# EAGLE design WildfireDetectionSystem (EAGLE 9.6.2)
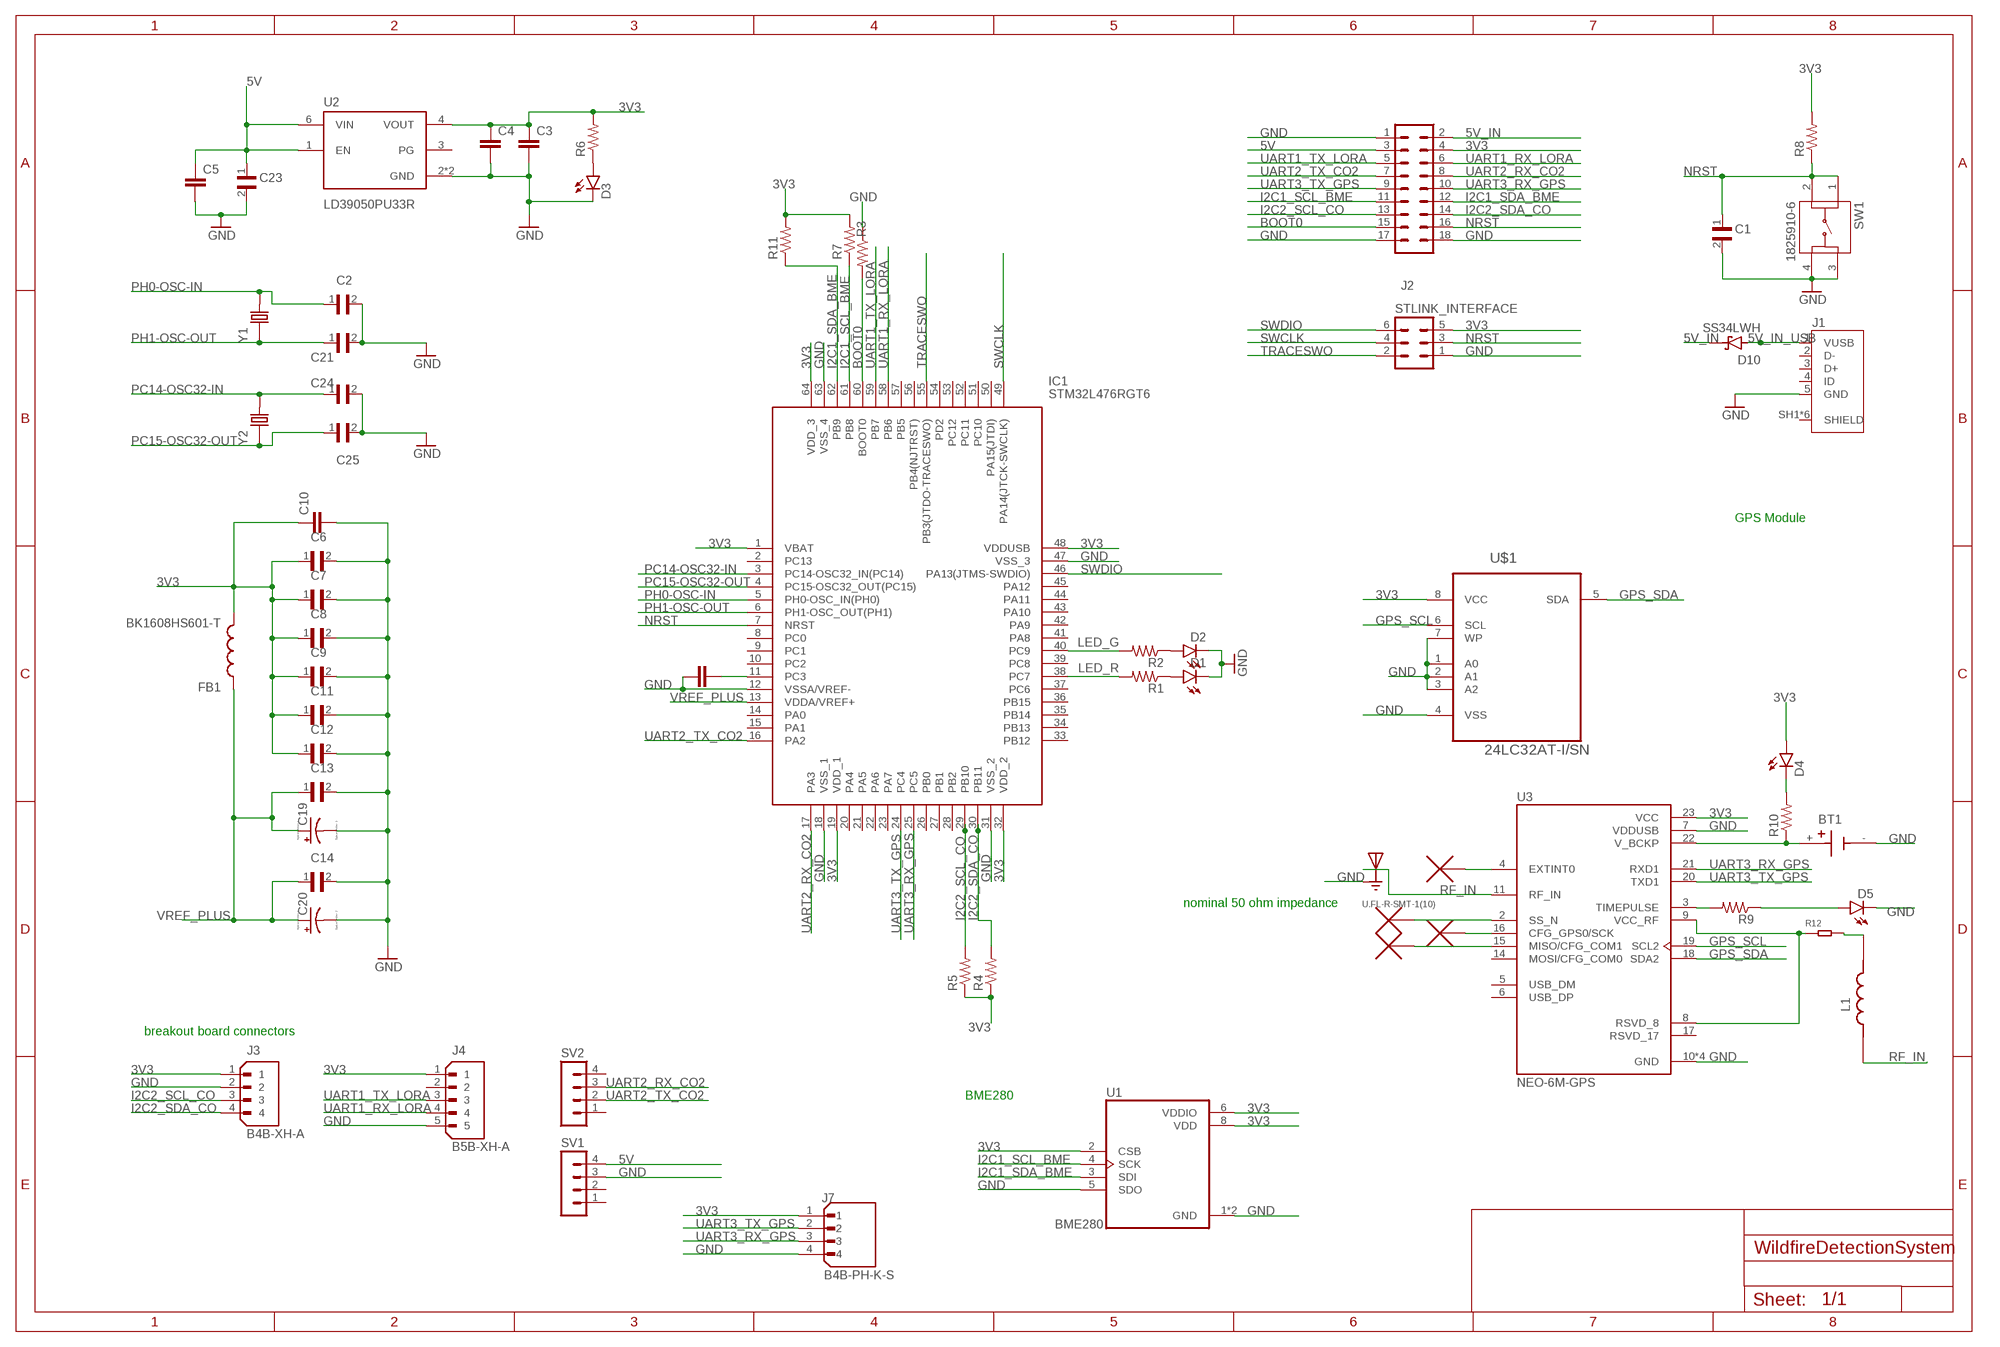
[diagram p0: schematic, sheet 1, part 1 of 2]
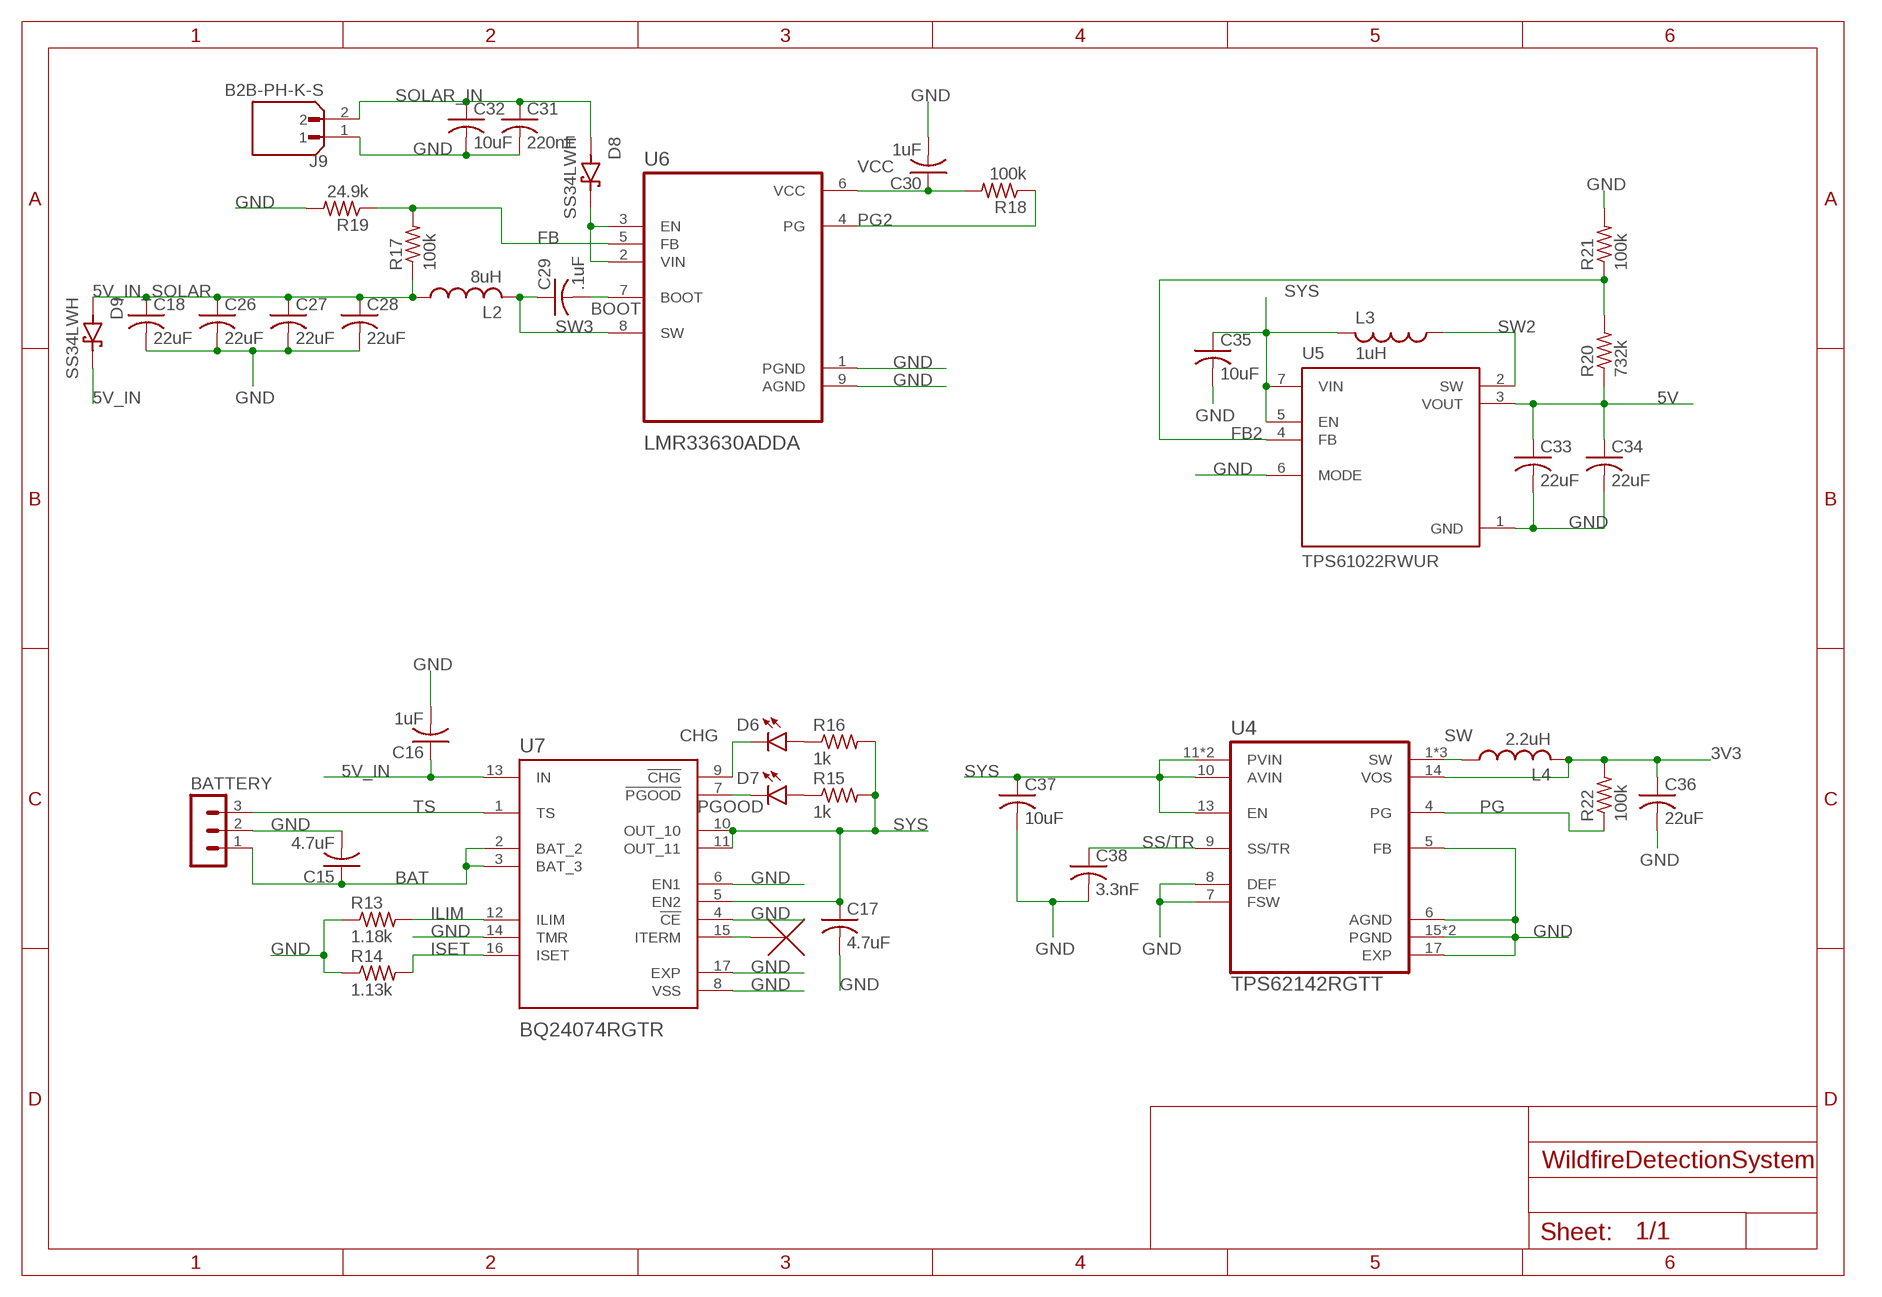
[diagram p1: schematic, sheet 1, part 2 of 2]

## Parts
BATTERY  MA03-1  [MA03-1]
BT1  MS621FE-FL11E  [BAT_MS621FE-FL11E]
C1  CL05B104KO5NNNC  [CAPC1005X55N]
C2  CL10C200JB8NNNC  [CAPC1608X90N]
C3  CC0402KRX7R7BB104  [CAPC1005X55N]
C4  CC0603KRX5R7BB105  [CAPC1608X90]
C5  CC0603KRX5R7BB105  [CAPC1608X90]
C6  CL05B104KO5NNNC  [CAPC1005X55N]
C7  CL05B104KO5NNNC  [CAPC1005X55N]
C8  CL05B104KO5NNNC  [CAPC1005X55N]
C9  CL05B104KO5NNNC  [CAPC1005X55N]
C10  CC0603KRX5R7BB105  [CAPC1608X90]
C11  CL05B104KO5NNNC  [CAPC1005X55N]
C12  CL05B104KO5NNNC  [CAPC1005X55N]
C13  CL05B104KO5NNNC  [CAPC1005X55N]
C14  CL05B104KO5NNNC  [CAPC1005X55N]
C15  4.7uF  C-USC0603  [C0603]
C16  1uF  C-USC0603  [C0603]
C17  4.7uF  C-USC0603  [C0603]
C18  22uF  C-USC0603  [C0603]
C19  TAJA105K016RNJ  [CAPPM3216X180N]
C20  TAJA105K016RNJ  [CAPPM3216X180N]
C21  CL10C200JB8NNNC  [CAPC1608X90N]
C22  CC0603KRX5R7BB105  [CAPC1608X90]
C23  CL05B104KO5NNNC  [CAPC1005X55N]
C24  CL10C200JB8NNNC  [CAPC1608X90N]
C25  CL10C200JB8NNNC  [CAPC1608X90N]
C26  22uF  C-USC0603  [C0603]
C27  22uF  C-USC0603  [C0603]
C28  22uF  C-USC0603  [C0603]
C29  .1uF  C-USC0603  [C0603]
C30  1uF  C-USC0603  [C0603]
C31  220nF  C-USC0603  [C0603]
C32  10uF  C-USC0603  [C0603]
C33  22uF  C-USC0603  [C0603]
C34  22uF  C-USC0603  [C0603]
C35  10uF  C-USC0603  [C0603]
C36  22uF  C-USC0603  [C0603]
C37  10uF  C-USC0603  [C0603]
C38  3.3nF  C-USC0603  [C0603]
D1  SML-P12MTT86  [LED_SML-P11UTT86R]
D2  SML-P12MTT86  [LED_SML-P11UTT86R]
D3  SML-P12MTT86  [LED_SML-P11UTT86R]
D4  SML-P12VTT86  [LED_SML-P11UTT86R]
D5  SML-P12MTT86  [LED_SML-P11UTT86R]
D6  SML-P12MTT86  [LED_SML-P11UTT86R]
D7  SML-P12VTT86  [LED_SML-P11UTT86R]
D8  SS34LWH  [SODFL3718X102N]
D9  SS34LWH  [SODFL3718X102N]
D10  SS34LWH  [SODFL3718X102N]
FB1  BK1608HS601-T  [BEADC1608X95N]
IC1  STM32L476RGT6  [QFP50P1200X1200X160-64N]
J1  10118192-0001LF  [AMPHENOL_10118192-0001LF]
J2  MA09-2  [MA09-2]
J3  B4B-XH-A  [JST_B4B-XH-A]
J4  B5B-XH-A  [JST_B5B-XH-A]
J7  B4B-PH-K-S  [JST_B4B-PH-K-S]
J8  U.FL-R-SMT-1(10)  [HRS_U.FL-R-SMT-1(10)]
J9  B2B-PH-K-S  [JST_B2B-PH-K-S]
L1  MLZ2012P220WT000  [INDC2012X145N]
L2  8uH  L-USL3225M  [L3225M]
L3  1uH  L-USL3225M  [L3225M]
L4  2.2uH  L-USL3225M  [L3225M]
R1  RC0402FR-071KL  [RESC1005X40N]
R2  RC0402FR-071KL  [RESC1005X40N]
R3  RC0402FR-071KL  [RESC1005X40N]
R4  RC0402FR-071KL  [RESC1005X40N]
R5  RC0402FR-071KL  [RESC1005X40N]
R6  RC0402FR-071KL  [RESC1005X40N]
R7  RT0402FRE074K7L  [RESC1005X35N]
R8  RC0402FR-0710KL  [RESC1005X40N]
R9  RC0402FR-071KL  [RESC1005X40N]
R10  RC0402FR-071KL  [RESC1005X40N]
R11  RT0402FRE074K7L  [RESC1005X35N]
R12  SMD-RES-22R-1%-1/16W(0402)  [R0402]
R13  1.18k  R-US_R0603  [R0603]
R14  1.13k  R-US_R0603  [R0603]
R15  1k  R-US_R0603  [R0603]
R16  1k  R-US_R0603  [R0603]
R17  100k  R-US_R0603  [R0603]
R18  100k  R-US_R0603  [R0603]
R19  24.9k  R-US_R0603  [R0603]
R20  732k  R-US_R0603  [R0603]
R21  100k  R-US_R0603  [R0603]
R22  100k  R-US_R0603  [R0603]
STLINK_INTERFACE  MA03-2  [MA03-2]
SV1  MA04-1  [MA04-1]
SV2  MA04-1  [MA04-1]
SW1  1825910-6  [SW_1825910-6-4]
U1  BME280  [PSON65P250X250X100-8N]
U2  LD39050PU33R  [SON95P300X300X100-7N]
U3  NEO-6M-GPS  [XCVR_NEO-6M-GPS]
U4  TPS62142RGTT  [QFN50P300X300X100-17N]
U5  TPS61022RWUR  [CONV_TPS61022RWUR]
U6  LMR33630ADDA  [VREG_LM5017MR/NOPB]
U7  BQ24074RGTR  [QFN50P300X300X100-17N]
U$1  24LC32AT-I/SN  [SOIC127P794X203-8N]
U$3  NC_MARKER  (no package)
U$4  NC_MARKER  (no package)
U$5  NC_MARKER  (no package)
U$6  NC_MARKER  (no package)
U$7  NC_MARKER  (no package)
Y1  ABLS-8.000MHZ-B2-T  [XTAL_ABLS-8.000MHZ-B2-T]
Y2  ECS-.327-12.5-12QS-TR  [XTAL_ECS-.327-12.5-12QS-TR]

## Nets
3V3: C3.1 C4.1 C6.1 C7.1 C8.1 C9.1 C10.1 C11.1 C12.1 C36.1 D4.A FB1.2 IC1.1(VBAT) IC1.19(VDD_1) IC1.32(VDD_2) IC1.48(VDDUSB) IC1.64(VDD_3) J2.4 J3.1 J4.1 J7.1 L4.2 R4.1 R5.1 R6.2 R7.2 R8.2 R11.2 R22.2 STLINK_INTERFACE.5 U1.2(CSB) U1.6(VDDIO) U1.8(VDD) U2.4(VOUT) U3.23(VCC) U4.14(VOS) U$1.8(VCC)
5V: C5.1 C23.1 C33.1 C34.1 J2.3 R20.1 SV1.4 U2.1(EN) U2.6(VIN) U5.3(VOUT)
5V_IN: C16.1 D9.C(K) D10.C(K) J2.2 U7.13(IN)
5V_IN_SOLAR: C18.1 C26.1 C27.1 C28.1 D9.A L2.1 R17.1
5V_IN_USB: D10.A J1.1(VUSB)
BAT: BATTERY.1 C15.1 U7.2(BAT_2) U7.3(BAT_3)
BOOT: C29.2 U6.7(BOOT)
BOOT0: IC1.60(BOOT0) J2.15 R3.2
CHG: D6.C U7.9(!CHG)
FB: R17.2 R19.1 U6.5(FB)
FB2: R20.2 R21.1 U5.4(FB)
GND: BATTERY.2 BT1.- C1.2 C2.2 C3.2 C4.2 C5.2 C6.2 C7.2 C8.2 C9.2 C10.2 C11.2 C12.2 C13.2 C14.2 C15.2 C16.2 C17.2 C18.2 C19.C(-) C20.C(-) C21.2 C22.1 C23.2 C24.2 C25.2 C26.2 C27.2 C28.2 C30.2 C31.2 C32.2 C33.2 C34.2 C35.2 C36.2 C37.2 C38.2 D1.C D2.C D3.C D5.C IC1.12(VSSA/VREF-) IC1.18(VSS_1) IC1.31(VSS_2) IC1.47(VSS_3) IC1.63(VSS_4) J1.5(GND) J2.1 J2.17 J2.18 J3.2 J4.5 J7.4 J8.1(GND) J8.3(GND) J9.1 R3.1 R13.1 R14.1 R19.2 R21.2 STLINK_INTERFACE.1 SV1.3 SW1.3 SW1.4 U1.1(GND) U1.5(SDO) U1.7(GND) U2.2(GND) U2.7(GND) U3.7(VDDUSB) U3.10(GND) U3.12(GND) U3.13(GND) U3.24(GND) U4.5(FB) U4.6(AGND) U4.7(FSW) U4.8(DEF) U4.15(PGND) U4.16(PGND) U4.17(EXP) U5.1(GND) U5.6(MODE) U6.1(PGND) U6.9(AGND) U7.4(!CE) U7.6(EN1) U7.8(VSS) U7.14(TMR) U7.17(EXP) U$1.1(A0) U$1.2(A1) U$1.3(A2) U$1.4(VSS) U$1.7(WP)
GPS_SCL: U3.19(SCL2) U$1.6(SCL)
GPS_SDA: U3.18(SDA2) U$1.5(SDA)
I2C1_SCL_BME: IC1.61(PB8) J2.11 R7.1 U1.4(SCK)
I2C1_SDA_BME: IC1.62(PB9) J2.12 R11.1 U1.3(SDI)
I2C2_SCL_CO: IC1.29(PB10) J2.13 J3.3 R5.2
I2C2_SDA_CO: IC1.30(PB11) J2.14 J3.4 R4.2
ILIM: R13.2 U7.12(ILIM)
ISET: R14.2 U7.16(ISET)
LED_G: IC1.40(PC9) R2.2
LED_R: IC1.38(PC7) R1.2
N$1: D3.A R6.1
N$2: D1.A R1.1
N$3: R9.2 U3.3(TIMEPULSE)
N$4: D2.A R2.1
N$5: U3.16(CFG_GPS0/SCK) U$3.P$1
N$6: C22.2 IC1.11(PC3)
N$7: D4.C R10.2
N$8: R12.1 U3.8(RSVD_8) U3.9(VCC_RF)
N$9: L1.2 R12.2
N$10: BT1.+ R10.1 U3.22(V_BCKP)
N$11: U3.4(EXTINT0) U$4.P$1
N$12: D5.A R9.1
N$13: U3.2(SS_N) U$6.P$1
N$14: U3.15(MISO/CFG_COM1) U$7.P$1
N$15: D8.C(K) U6.2(VIN) U6.3(EN)
N$17: D6.A R16.1
N$18: D7.A R15.1
N$28: U7.15(ITERM) U$5.P$1
NRST: C1.1 IC1.7(NRST) J2.16 R8.1 STLINK_INTERFACE.3 SW1.1 SW1.2
PC14-OSC32-IN: C24.1 IC1.3(PC14-OSC32_IN(PC14)) Y2.2
PC15-OSC32-OUT: C25.1 IC1.4(PC15-OSC32_OUT(PC15)) Y2.1
PG: R22.1 U4.4(PG)
PG2: R18.1 U6.4(PG)
PGOOD: D7.C U7.7(!PGOOD)
PH0-OSC-IN: C2.1 IC1.5(PH0-OSC_IN(PH0)) Y1.2
PH1-OSC-OUT: C21.1 IC1.6(PH1-OSC_OUT(PH1)) Y1.1
RF_IN: J8.2(SIG) L1.1 U3.11(RF_IN)
SOLAR_IN: C31.1 C32.1 D8.A J9.2
SS/TR: C38.1 U4.9(SS/TR)
SW: L4.1 U4.1(SW) U4.2(SW) U4.3(SW)
SW2: L3.1 U5.2(SW)
SW3: C29.1 L2.2 U6.8(SW)
SWCLK: IC1.49(PA14(JTCK-SWCLK)) STLINK_INTERFACE.4
SWDIO: IC1.46(PA13(JTMS-SWDIO)) STLINK_INTERFACE.6
SYS: C17.1 C35.1 C37.1 L3.2 R15.2 R16.2 U4.10(AVIN) U4.11(PVIN) U4.12(PVIN) U4.13(EN) U5.5(EN) U5.7(VIN) U7.5(EN2) U7.10(OUT_10) U7.11(OUT_11)
TRACESWO: IC1.55(PB3(JTDO-TRACESWO)) STLINK_INTERFACE.2
TS: BATTERY.3 U7.1(TS)
UART1_RX_LORA: IC1.58(PB6) J2.6 J4.4
UART1_TX_LORA: IC1.59(PB7) J2.5 J4.3
UART2_RX_CO2: IC1.17(PA3) J2.8 SV2.3
UART2_TX_CO2: IC1.16(PA2) J2.7 SV2.2
UART3_RX_GPS: IC1.25(PC5) J2.10 J7.3 U3.21(RXD1)
UART3_TX_GPS: IC1.24(PC4) J2.9 J7.2 U3.20(TXD1)
VCC: C30.1 R18.2 U6.6(VCC)
VREF_PLUS: C13.1 C14.1 C19.A(+) C20.A(+) FB1.1 IC1.13(VDDA/VREF+)
Unconnected: IC1.2(PC13) IC1.8(PC0) IC1.9(PC1) IC1.10(PC2) IC1.14(PA0) IC1.15(PA1) IC1.20(PA4) IC1.21(PA5) IC1.22(PA6) IC1.23(PA7) IC1.26(PB0) IC1.27(PB1) IC1.28(PB2) IC1.33(PB12) IC1.34(PB13) IC1.35(PB14) IC1.36(PB15) IC1.37(PC6) IC1.39(PC8) IC1.41(PA8) IC1.42(PA9) IC1.43(PA10) IC1.44(PA11) IC1.45(PA12) IC1.50(PA15(JTDI)) IC1.51(PC10) IC1.52(PC11) IC1.53(PC12) IC1.54(PD2) IC1.56(PB4(NJTRST)) IC1.57(PB5) J1.2(D-) J1.3(D+) J1.4(ID) J1.SH1(SHIELD) J1.SH2(SHIELD) J1.SH3(SHIELD) J1.SH4(SHIELD) J1.SH5(SHIELD) J1.SH6(SHIELD) J4.2 SV1.1 SV1.2 SV2.1 SV2.4 U2.3(PG) U3.5(USB_DM) U3.6(USB_DP) U3.14(MOSI/CFG_COM0) U3.17(RSVD_17)

## Notes on the sheet
- GPS Module
- nominal 50 ohm impedance
- breakout board connectors
- BME280

## Library data of the parts
BATTERY = con-lstb:MA03-1: PIN HEADER; OC_FARNELL: unknown; OC_NEWARK: unknown
BT1 = MS621FE-FL11E:MS621FE-FL11E; CHECK_PRICES: https://www.snapeda.com/parts/MS621FE-FL11E/Seiko/view-part/?ref=eda; DESCRIPTION: Coin, 6.8mm 3 V Lithium Battery Rechargeable (Secondary) 5.5mAh; DIGIKEY_PART_NUMBER: 728-1057-ND; MF: Seiko Instruments; MP: MS621FE-FL11E; PACKAGE: QFP-128 Seiko; SNAPEDA_LINK: https://www.snapeda.com/parts/MS621FE-FL11E/Seiko/view-part/?ref=snap
C1 C6-C9 C11-C14 C23 = CL05B104KO5NNNC:CL05B104KO5NNNC; CHECK_PRICES: https://www.snapeda.com/parts/CL05B104KO5NNNC/Samsung/view-part/?ref=eda; DESCRIPTION: 0.1 µF ±10% 16V Ceramic Capacitor X7R 0402 (1005 Metric); DIGIKEY_PART_NUMBER: 1276-1001-1-ND; MF: Samsung; MP: CL05B104KO5NNNC; PACKAGE: SMD-2 Samsung; SNAPEDA_LINK: https://www.snapeda.com/parts/CL05B104KO5NNNC/Samsung/view-part/?ref=snap
C2 C21 C24 C25 = CL10C200JB8NNNC:CL10C200JB8NNNC; CHECK_PRICES: https://www.snapeda.com/parts/CL10C200JB8NNNC/Samsung/view-part/?ref=eda; DESCRIPTION: 20 pF ±5% 50V Ceramic Capacitor C0G, NP0 0603 (1608 Metric); DIGIKEY_PART_NUMBER: 1276-1187-1-ND; MF: Samsung; MP: CL10C200JB8NNNC; PACKAGE: SMD-2 Samsung; SNAPEDA_LINK: https://www.snapeda.com/parts/CL10C200JB8NNNC/Samsung/view-part/?ref=snap
C3 = ce-capstone:CC0402KRX7R7BB104: .1UF 16V 10% 0402; DESCRIPTION: 0.1µF ±10% 16V Ceramic Capacitor X7R 0402 _1005 Metric_; DIGI-KEY_PART_NUMBER: 311-1338-1-ND; DIGI-KEY_PURCHASE_URL: https://www.digikey.com/product-detail/en/yageo/CC0402KRX7R7BB104/311-1338-1-ND/2103122?utm_source=snapeda&utm_medium=aggregator&utm_campaign=symbol; MF: Yageo; MP: CC0402KRX7R7BB104; PACKAGE: 0402 Yageo
C4 C5 C10 C22 = ce-capstone:CC0603KRX5R7BB105: CAPACITOR CERAMIC, 1µF, 10V, X5R, 0603; Dielectric Characteristic:X5R; Capacitance:1µF; Capacitance Tolerance:± 10%; Voltage Rating:16V; Temperature Coefficient:± 15%; Capacitor Case Style:0603; No. of Pins:2; Mounting Type:SMD ;RoHS Compliant: Yes; DESCRIPTION: 1µF ±10% 16V Ceramic Capacitor X5R 0603 _1608 Metric_; DIGI-KEY_PART_NUMBER: 311-1444-1-ND; DIGI-KEY_PURCHASE_URL: https://www.digikey.com/product-detail/en/yageo/CC0603KRX5R7BB105/311-1444-1-ND/2833750?utm_source=snapeda&utm_medium=aggregator&utm_campaign=symbol; MF: Yageo; MP: CC0603KRX5R7BB105; PACKAGE: 0603 Yageo
C15-C18 C26-C38 = rcl:C-US: CAPACITOR, American symbol; SPICEPREFIX: C
C19 C20 = ce-capstone:TAJA105K016RNJ: Capacitor tantalum TAJ 1206 1uF 16V AVX 1uF SMD Solid MnO2 Tantalum Electrolytic Capacitor, 16 V dc +/-10%, TAJ Series Source: Datasheet <http://www.farnell.com/datasheets/1680476.pdf>; ALLIED_NUMBER: 70474975; ALLIED_PRICE-STOCK: https://www.alliedelec.com/avx-taja105k016r/70474975/; DESCRIPTION: Capacitor tantalum TAJ 1206 1uF 16V AVX 1uF SMD Solid MnO2 Tantalum Electrolytic Capacitor, 16 V dc +/-10%, TAJ Series; HEIGHT: 1.8mm; MANUFACTURER_NAME: AVX; MANUFACTURER_PART_NUMBER: TAJA105K016RNJ; MOUSER_PART_NUMBER: 581-TAJA105K016RNJ; MOUSER_PRICE-STOCK: https://www.mouser.com/Search/Refine.aspx?Keyword=581-TAJA105K016R; RS_PART_NUMBER: 6992804P; RS_PRICE-STOCK: http://uk.rs-online.com/web/p/products/6992804P
D1-D3 D5 D6 = ce-capstone:SML-P12MTT86: SML-P1 Series Red 0402 Clear 60 mcd 2 V Surface Mount PICOLED LED; AVAILABILITY: Unavailable; DESCRIPTION: Green 572nm LED Indication - Discrete 2V 0402 _1006 Metric_; MF: Rohm; MP: SML-P12MTT86; PACKAGE: 0402 Rohm; PRICE: None
D4 D7 = ce-capstone:SML-P12VTT86: SML-P1 Series Red 0402 Clear 60 mcd 2 V Surface Mount PICOLED LED; AVAILABILITY: Unavailable; DESCRIPTION: Red 630nm LED Indication - Discrete 2V 0402 _1006 Metric_; MF: Rohm; MP: SML-P12VTT86; PACKAGE: 0402 Rohm; PRICE: None
D8-D10 = SS34LWH:SS34LWH: Check availability <https://pricing.snapeda.com/parts/SS34LWH/Taiwan%20Semiconductor/view-part?ref=eda>; AVAILABILITY: In Stock; CHECK_PRICES: https://www.snapeda.com/parts/SS34LWH/taiwan/view-part/?ref=eda; DESCRIPTION: 3A, 40V, Automotive Planar Schottky; MF: Taiwan Semiconductor; MP: SS34LWH; PACKAGE: SOD-123W-2 Taiwan Semiconductor; PRICE: None; SNAPEDA_LINK: https://www.snapeda.com/parts/SS34LWH/taiwan/view-part/?ref=snap
FB1 = ce-capstone:BK1608HS601-T: Ferrite Chip Bead(Lead Free) Source: Datasheet <https://www.tai-tech.com.tw/_upload/files/FCM1608-Series.pdf>; DESCRIPTION: Ferrite Chip Bead(Lead Free); HEIGHT: 0.95mm; MANUFACTURER_NAME: Taiyo Yuden; MANUFACTURER_PART_NUMBER: BK1608HS601-T
IC1 = STM32L476RGT6:STM32L476RGT6: ARM MCU 32-bit 80MHz 1024KB LQFP64 STMicroelectronics STM32L476RGT6, 32bit ARM Cortex M4 MCU, 80MHz, 1 MB Flash, 64-Pin LQFP Source: Datasheet <https://www.st.com/resource/en/datasheet/stm32l476je.pdf>; ARROW_PART_NUMBER: STM32L476RGT6; ARROW_PRICE-STOCK: https://www.arrow.com/en/products/stm32l476rgt6/stmicroelectronics?utm_currency=USD&region=nac; DESCRIPTION: ARM MCU 32-bit 80MHz 1024KB LQFP64 STMicroelectronics STM32L476RGT6, 32bit ARM Cortex M4 MCU, 80MHz, 1 MB Flash, 64-Pin LQFP; HEIGHT: 1.6mm; MANUFACTURER_NAME: STMicroelectronics; MANUFACTURER_PART_NUMBER: STM32L476RGT6; MOUSER_PART_NUMBER: 511-STM32L476RGT6; MOUSER_PRICE-STOCK: https://www.mouser.co.uk/ProductDetail/STMicroelectronics/STM32L476RGT6?qs=o58qnh%2FCpu44V%252B7CaDZzCA%3D%3D
J1 = ce-capstone:10118192-0001LF: Single Port 5 Contact Horizontal Right Angle Shielded Micro B USB 2.0 Connector; AVAILABILITY: Unavailable; DESCRIPTION: USB - micro B USB 2.0 Receptacle Connector 5 Position Surface Mount, Right Angle; MF: Amphenol ICC; MP: 10118192-0001LF; PACKAGE: None; PRICE: None
J2 = con-lstb:MA09-2: PIN HEADER; OC_FARNELL: unknown; OC_NEWARK: unknown
J3 = B4B-XH-A:B4B-XH-A; CHECK_PRICES: https://www.snapeda.com/parts/B4B-XH-A/JST/view-part/?ref=eda; DESCRIPTION: Conn Shrouded Header (4 Sides) HDR 4 POS 2.5mm Solder ST Top Entry Thru-Hole Box; DIGIKEY_PART_NUMBER: 455-B4B-XH-A-ND; MF: JST; MP: B4B-XH-A; PACKAGE: None; SNAPEDA_LINK: https://www.snapeda.com/parts/B4B-XH-A/JST/view-part/?ref=snap
J4 = B5B-XH-A:B5B-XH-A; CHECK_PRICES: https://www.snapeda.com/parts/B5B-XH-A/JST/view-part/?ref=eda; DESCRIPTION: JST Pin header, single-row straight 5-pin Header / Plug 5 Positions 2.5mm; DIGIKEY_PART_NUMBER: 455-B5B-XH-A-ND; MF: JST; MP: B5B-XH-A; PACKAGE: None; SNAPEDA_LINK: https://www.snapeda.com/parts/B5B-XH-A/JST/view-part/?ref=snap
J7 = B4B-PH-K-S:B4B-PH-K-S: Check availability <https://pricing.snapeda.com/parts/B4B-PH-K-S/JST%20Sales/view-part?ref=eda>; AVAILABILITY: In Stock; CHECK_PRICES: https://www.snapeda.com/parts/B4B-PH-K-S/JST/view-part/?ref=eda; DESCRIPTION: Connector Header Through Hole 4 position 0.079 (2.00mm); MF: JST Sales; MP: B4B-PH-K-S; PACKAGE: None; PRICE: None; PURCHASE-URL: https://www.snapeda.com/api/url_track_click_mouser/?unipart_id=515305&manufacturer=JST Sales&part_name=B4B-PH-K-S&search_term=b4b-ph-k-s; SNAPEDA_LINK: https://www.snapeda.com/parts/B4B-PH-K-S/JST/view-part/?ref=snap
J8 = U.FL-R-SMT-1_10_:U.FL-R-SMT-1(10): Check availability <https://pricing.snapeda.com/parts/U.FL-R-SMT-1%2810%29/Hirose/view-part?ref=eda>; AVAILABILITY: In Stock; CHECK_PRICES: https://www.snapeda.com/parts/U.FL-R-SMT-1(10)/Hirose+Electric+Co+Ltd/view-part/?ref=eda; DESCRIPTION: U.FL (UMCC) Connector Receptacle, Male Pin 50 Ohms Surface Mount Solder; MF: Hirose; MP: U.FL-R-SMT-1(10); PACKAGE: None; PRICE: None; PURCHASE-URL: https://www.snapeda.com/api/url_track_click_mouser/?unipart_id=55192&manufacturer=Hirose&part_name=U.FL-R-SMT-1(10)&search_term=u.fl-r-smt-1(10); SNAPEDA_LINK: https://www.snapeda.com/parts/U.FL-R-SMT-1(10)/Hirose+Electric+Co+Ltd/view-part/?ref=snap
J9 = B2B-PH-K-S:B2B-PH-K-S: Check availability <https://pricing.snapeda.com/parts/B2B-PH-K-S/JST%20Sales/view-part?ref=eda>; AVAILABILITY: In Stock; CHECK_PRICES: https://www.snapeda.com/parts/B2B-PH-K-S/JST/view-part/?ref=eda; DESCRIPTION: Connector Header Through Hole 2 position 0.079 (2.00mm); MF: JST Sales; MP: B2B-PH-K-S; PACKAGE: None; PRICE: None; PURCHASE-URL: https://www.snapeda.com/api/url_track_click_mouser/?unipart_id=473612&manufacturer=JST Sales&part_name=B2B-PH-K-S&search_term=b2b-ph-k-s; SNAPEDA_LINK: https://www.snapeda.com/parts/B2B-PH-K-S/JST/view-part/?ref=snap
L1 = MLZ2012P220WT000:MLZ2012P220WT000; CHECK_PRICES: https://www.snapeda.com/parts/MLZ2012P220WT000/TDK/view-part/?ref=eda; DESCRIPTION: 22 µH Shielded Multilayer Inductor 220 mA 1.25Ohm 0805 (2012 Metric); DIGIKEY_PART_NUMBER: 445-15751-1-ND; MF: TDK; MP: MLZ2012P220WT000; PACKAGE: 2012 Bourns; SNAPEDA_LINK: https://www.snapeda.com/parts/MLZ2012P220WT000/TDK/view-part/?ref=snap
L2-L4 = rcl:L-US: INDUCTOR, American symbol; SPICEPREFIX: L
R1-R6 R9 R10 = ce-capstone:RC0402FR-071KL: RES SMD 1k OHM 1% 1/16W 0402; DESCRIPTION: 510 Ohms ±1% 0.063W, 1/16W Chip Resistor 0402 _1005 Metric_ Moisture Resistant Thick Film; DIGI-KEY_PART_NUMBER: 311-510LRCT-ND; DIGI-KEY_PURCHASE_URL: https://www.digikey.com/product-detail/en/yageo/RC0402FR-07510RL/311-510LRCT-ND/729579?utm_source=snapeda&utm_medium=aggregator&utm_campaign=symbol; MF: Yageo; MP: RC0402FR-07510RL; PACKAGE: 1005 Panasonic Electronic Components
R7 R11 = ce-capstone:RT0402FRE074K7L: RES SMD 4.7K OHM 1% 1/16W 0402; DESCRIPTION: 4.7 kOhms ±1% 0.063W, 1/16W Chip Resistor 0402 _1005 Metric_ Thin Film; DIGI-KEY_PART_NUMBER: YAG3347CT-ND; DIGI-KEY_PURCHASE_URL: https://www.digikey.com/product-detail/en/yageo/RT0402FRE074K7L/YAG3347CT-ND/5418052?utm_source=snapeda&utm_medium=aggregator&utm_campaign=symbol; MF: Yageo; MP: RT0402FRE074K7L; PACKAGE: 1005 Yageo
R8 = ce-capstone:RC0402FR-0710KL: RES SMD 10k OHM 1% 1/16W 0402; DESCRIPTION: 510 Ohms ±1% 0.063W, 1/16W Chip Resistor 0402 _1005 Metric_ Moisture Resistant Thick Film; DIGI-KEY_PART_NUMBER: 311-510LRCT-ND; DIGI-KEY_PURCHASE_URL: https://www.digikey.com/product-detail/en/yageo/RC0402FR-07510RL/311-510LRCT-ND/729579?utm_source=snapeda&utm_medium=aggregator&utm_campaign=symbol; MF: Yageo; MP: RC0402FR-07510RL; PACKAGE: 1005 Panasonic Electronic Components
R12 = SMD-RES-22R-1_-1_16W_0402_:SMD-RES-22R-1%-1/16W(0402); CHECK_PRICES: https://www.snapeda.com/parts/RC0402FR-0722RL/Yageo/view-part/?ref=eda; DESCRIPTION: 22 Ohms ±1% 0.063W, 1/16W Chip Resistor 0402 (1005 Metric) Moisture Resistant Thick Film; DIGIKEY_PART_NUMBER: 311-22.0LRCT-ND; MF: Yageo; MP: RC0402FR-0722RL; PACKAGE: 0402 Yageo; SNAPEDA_LINK: https://www.snapeda.com/parts/RC0402FR-0722RL/Yageo/view-part/?ref=snap
R13-R22 = rcl:R-US_: RESISTOR, American symbol; SPICEPREFIX: R
STLINK_INTERFACE = con-lstb:MA03-2: PIN HEADER; OC_FARNELL: unknown; OC_NEWARK: unknown
SV1 SV2 = con-lstb:MA04-1: PIN HEADER; OC_FARNELL: unknown; OC_NEWARK: unknown
SW1 = ce-capstone:1825910-6: Switch Tactile OFF (ON) SPST Round Button PC Pins 0.05A 24VDC 100000Cycles 1.57N Thru-Hole Loose; AVAILABILITY: Unavailable; COMMENT: 1825910-6; CONFIGURATION_POLE-THROW: Single Pole - Single Throw; CONTACT_CURRENT_RATING: 50 mA; DESCRIPTION: Switch Push Button OFF _ON_ SPST Round Button 0.05A 24VDC Momentary Contact PC Pins Thru-Hole; EU_ROHS_COMPLIANCE: Compliant; MF: TE Connectivity; MP: 1825910-6; PACKAGE: None; PRICE: None; TE_PURCHASE_URL: https://www.te.com/usa-en/product-1825910-6.html?te_bu=Cor&te_type=disp&te_campaign=seda_glo_cor-seda-global-disp-prtnr-fy19-seda-model-bom-cta_sma-317_1&elqCampaignId=32493
U1 = BME280:BME280; CHECK_PRICES: https://www.snapeda.com/parts/BME280/Bosch/view-part/?ref=eda; DESCRIPTION: Board Mount Humidity Sensors MEMS humidity, pressure and temperature sensor; DIGIKEY_PART_NUMBER: 828-1063-1-ND; MF: Bosch; MP: BME280; PACKAGE: LGA-8 Bosch; SNAPEDA_LINK: https://www.snapeda.com/parts/BME280/Bosch/view-part/?ref=snap
U2 = ce-capstone:LD39050PU33R: LD39050 Series 500 mA 3.3 V Fixed Low Noise LDO Voltage Regulator - DFN-6; AVAILABILITY: Unavailable; DESCRIPTION: Linear Voltage Regulator IC 1 Output 500mA 6-DFN _3x3_; MF: STMicroelectronics; MP: LD39050PU33R; PACKAGE: DFN-6 STMicroelectronics; PRICE: None
U3 = NEO-6M-GPS:NEO-6M-GPS: Check availability <https://pricing.snapeda.com/parts/NEO-6M-GPS/u-blox/view-part?ref=eda>; AVAILABILITY: Not in stock; CHECK_PRICES: https://www.snapeda.com/parts/NEO-6M-GPS/u-blox/view-part/?ref=eda; DESCRIPTION: GPS Development Tools SparkFun GNSS-RTK Dead Reckoning Breakout - ZED-F9K (Qwiic); MF: u-blox; MP: NEO-6M-GPS; PACKAGE: None; PRICE: None; SNAPEDA_LINK: https://www.snapeda.com/parts/NEO-6M-GPS/u-blox/view-part/?ref=snap
U4 = TPS62142RGTT:TPS62142RGTT: Check availability <https://pricing.snapeda.com/parts/TPS62142RGTT/Texas%20Instruments/view-part?ref=eda>; AVAILABILITY: In Stock; CHECK_PRICES: https://www.snapeda.com/parts/TPS62142RGTT/Texas+Instruments/view-part/?ref=eda; DESCRIPTION: 3–17V 2A Step-Down Converter in 3x3 QFN package; MF: Texas Instruments; MP: TPS62142RGTT; PACKAGE: VQFN-16 Texas Instruments; PRICE: None; PURCHASE-URL: https://www.snapeda.com/api/url_track_click_mouser/?unipart_id=1002928&manufacturer=Texas Instruments&part_name=TPS62142RGTT&search_term=tps62142rgtt; SNAPEDA_LINK: https://www.snapeda.com/parts/TPS62142RGTT/Texas+Instruments/view-part/?ref=snap
U5 = TPS61022RWUR:TPS61022RWUR: Check availability <https://pricing.snapeda.com/parts/TPS61022RWUR/Texas%20Instruments/view-part?ref=eda>; AVAILABILITY: In Stock; CHECK_PRICES: https://www.snapeda.com/parts/TPS61022RWUR/Texas+Instruments/view-part/?ref=eda; DESCRIPTION: 8-A boost converter with 0.5-V ultra-low input voltage; MF: Texas Instruments; MP: TPS61022RWUR; PACKAGE: VQFN-HR-7 Texas Instruments; PRICE: None; SNAPEDA_LINK: https://www.snapeda.com/parts/TPS61022RWUR/Texas+Instruments/view-part/?ref=snap
U6 = LMR33630ADDA:LMR33630ADDA: Check availability <https://pricing.snapeda.com/parts/LMR33630ADDA/Texas%20Instruments/view-part?ref=eda>; AVAILABILITY: In Stock; CHECK_PRICES: https://www.snapeda.com/parts/LMR33630ADDA/Texas+Instruments/view-part/?ref=eda; DESCRIPTION: SIMPLE SWITCHER® 3.8V to 36V, 3A Synchronous Buck Converter With Ultra-Low EMI; MF: Texas Instruments; MP: LMR33630ADDA; PACKAGE: HSOIC-8 Texas Instruments; PRICE: None; PURCHASE-URL: https://www.snapeda.com/api/url_track_click_mouser/?unipart_id=2751243&manufacturer=Texas Instruments&part_name=LMR33630ADDA&search_term=lmr33630adda; SNAPEDA_LINK: https://www.snapeda.com/parts/LMR33630ADDA/Texas+Instruments/view-part/?ref=snap
U7 = BQ24074RGTR:BQ24074RGTR: Check availability <https://pricing.snapeda.com/parts/BQ24074RGTR/Texas%20Instruments/view-part?ref=eda>; AVAILABILITY: In Stock; CHECK_PRICES: https://www.snapeda.com/parts/BQ24074RGTR/Texas+Instruments/view-part/?ref=eda; DESCRIPTION: Standalone 1-cell 1.5-A linear battery charger, Power Path, 4.2-V VBAT, 10.5-V OVP and 4.4-V VOUT; MF: Texas Instruments; MP: BQ24074RGTR; PACKAGE: VQFN-16 Texas Instruments; PRICE: None; SNAPEDA_LINK: https://www.snapeda.com/parts/BQ24074RGTR/Texas+Instruments/view-part/?ref=snap
U$1 = 24LC32AT-I_SN:24LC32AT-I/SN; CHECK_PRICES: https://www.snapeda.com/parts/24LC32AT-I/SN/Microchip+Technology/view-part/?ref=eda; DESCRIPTION: 32K, 4K X 8, 2.5V SER EE IND8 SOIC 3.90mm(.150in) T/R | Microchip Technology Inc. 24LC32AT-I/SN; DIGIKEY_PART_NUMBER: 24LC32AT-I/SNCT-ND; MF: Microchip Technology; MP: 24LC32AT-I/SN; PACKAGE: SOIC-8 Microchip; SNAPEDA_LINK: https://www.snapeda.com/parts/24LC32AT-I/SN/Microchip+Technology/view-part/?ref=snap
U$3-U$7 = NC_MARKER:NC_MARKER
Y1 = ce-capstone:ABLS-8.000MHZ-B2-T: Crystal 8MHz Â±20ppm (Tol) Â±50ppm (Stability) 18pF FUND 80Ohm 2-Pin HC-49/US SMD T/R; AVAILABILITY: Unavailable; DESCRIPTION: 8MHz ±20ppm Crystal 18pF 80 Ohms HC-49/US; MF: Abracon LLC; MP: ABLS-8.000MHZ-B2; PACKAGE: HC-49/US Abracon LLC; PRICE: None
Y2 = ce-capstone:ECS-.327-12.5-12QS-TR: SMD CRYSTAL 32.768 KHz; AVAILABILITY: Unavailable; DESCRIPTION: 32.768kHz ±20ppm Crystal 12.5pF 90 kOhms 2-SMD, No Lead; MF: ECS Inc.; MP: ECS-.327-12.5-12QS-TR; PACKAGE: SMD-2 ECS International; PRICE: None

## Board
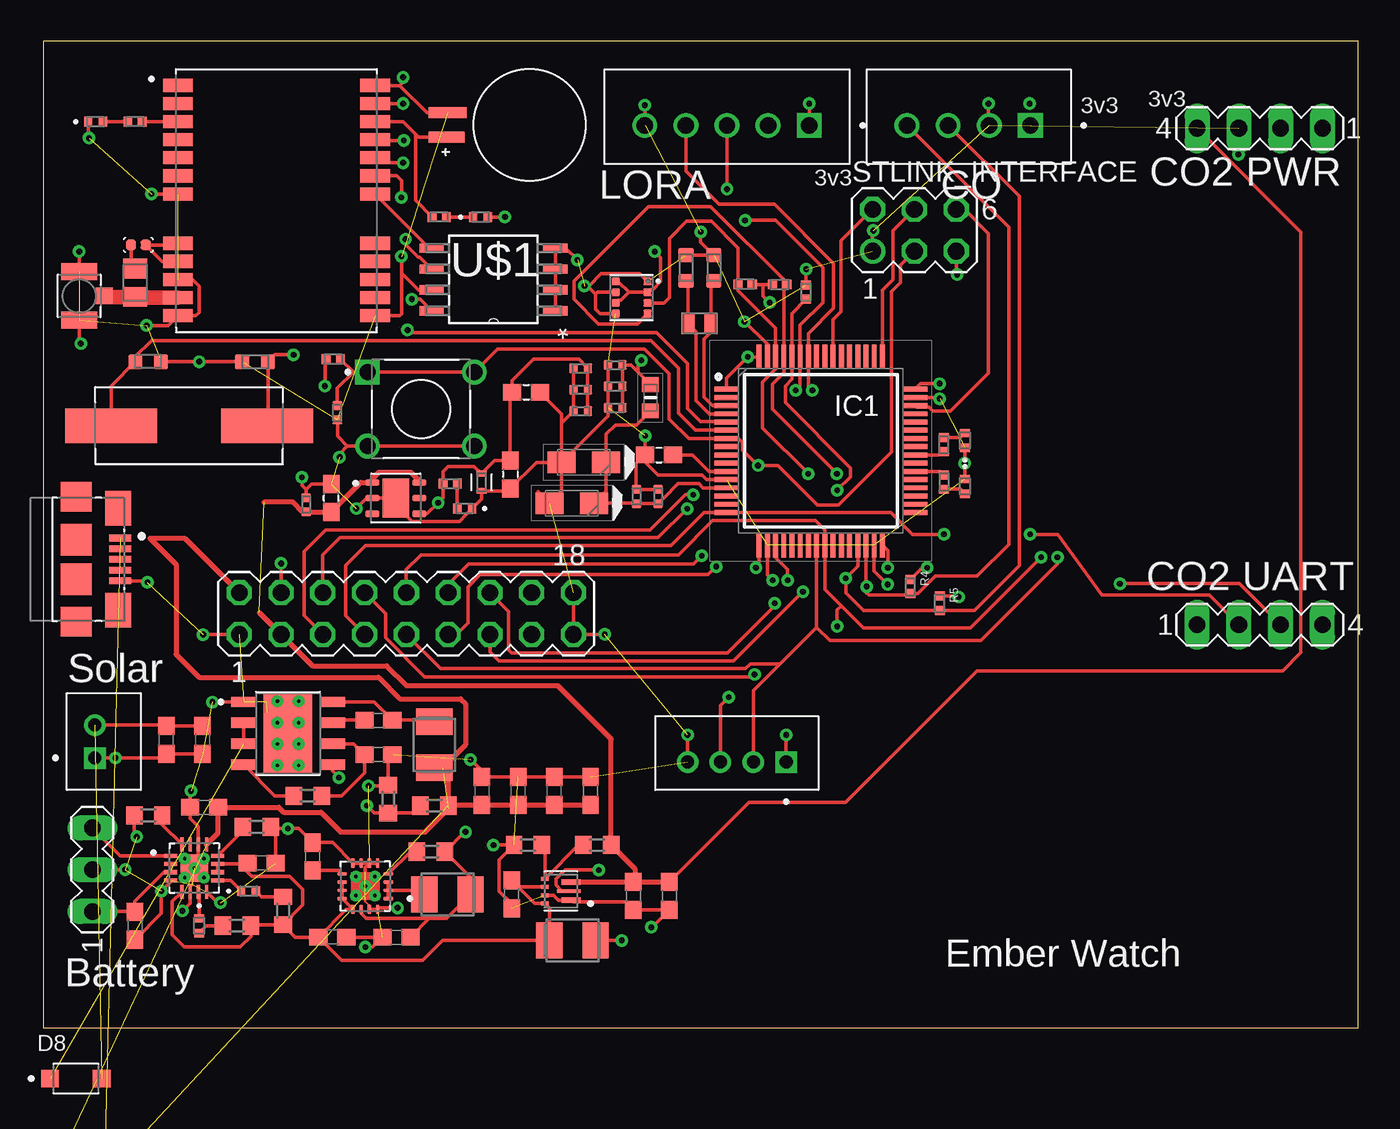
[diagram p2: board, top side]
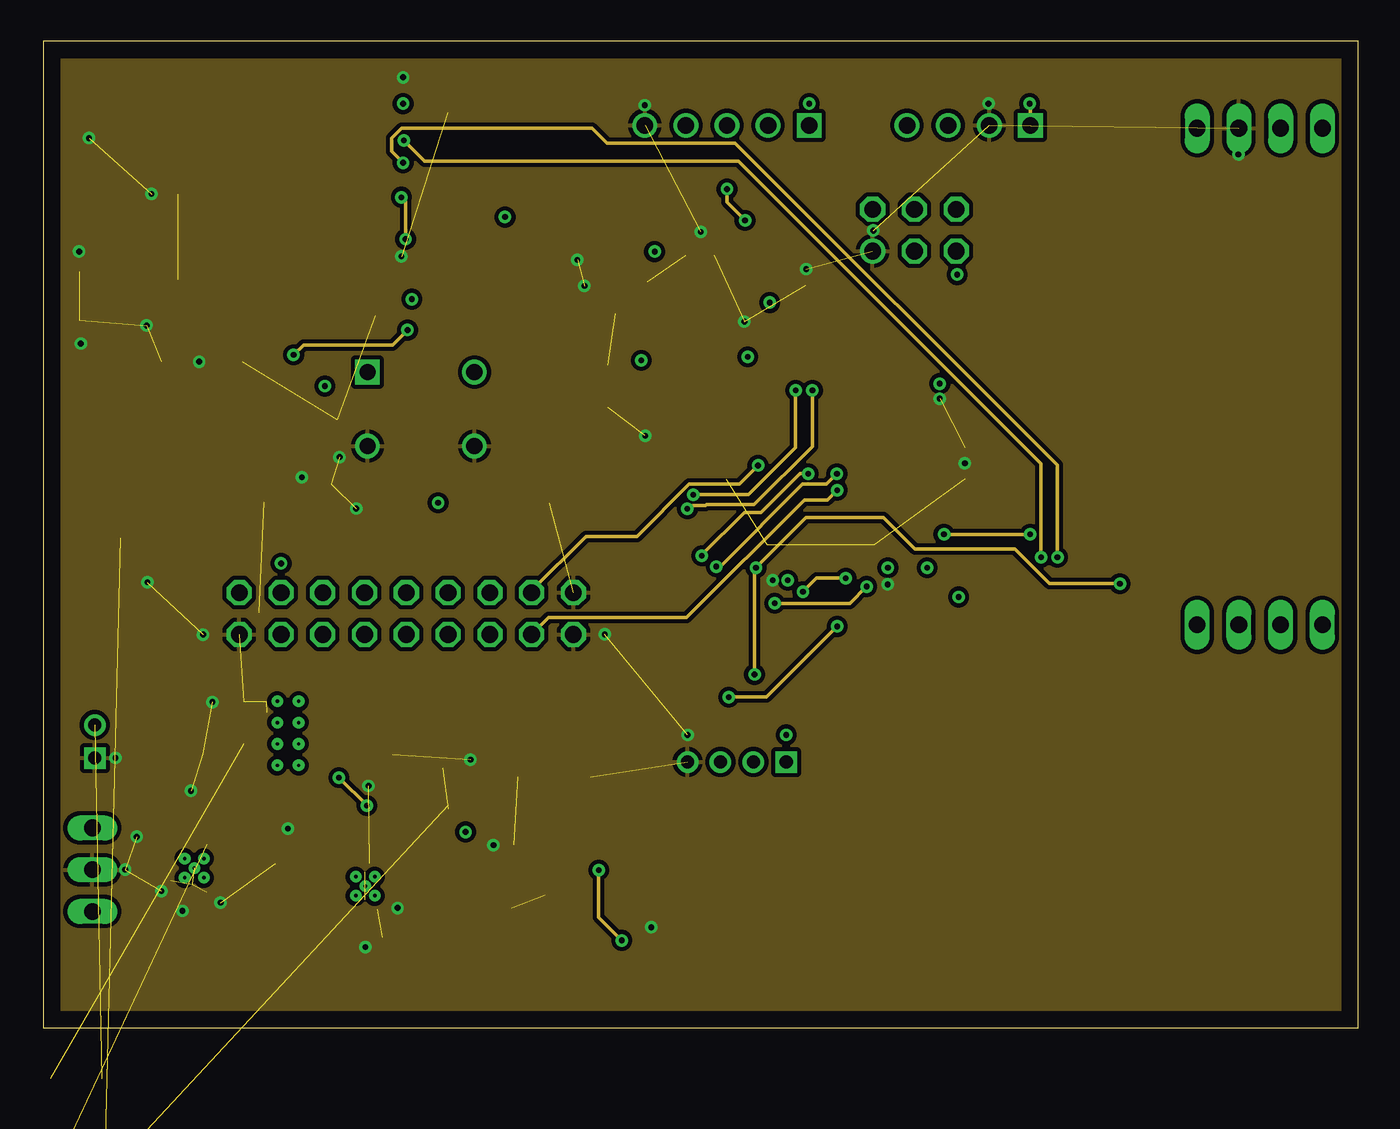
[diagram p3: board, inner layer Route2]
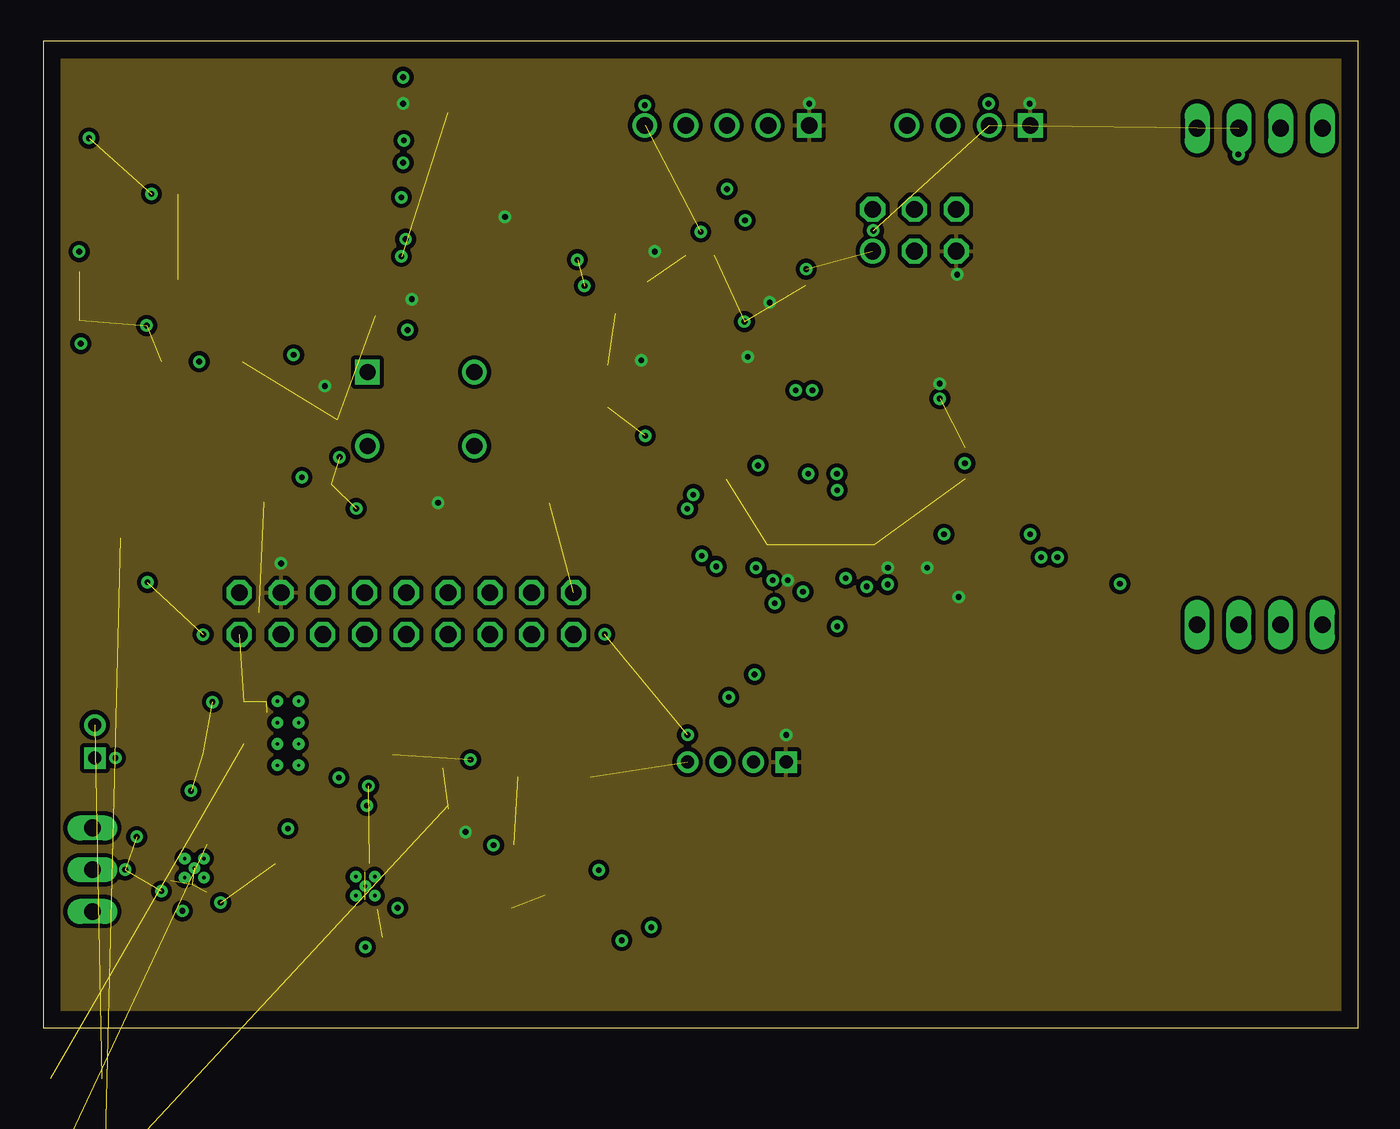
[diagram p4: board, inner layer Route3]

Size 80 x 60 mm. Coordinates in mm from the lower left corner, seen from the top.
Outline: 0,0 80,0 80,60 0,60 0,0
Copper layers (1+2*15+16): Top 0.035mm / dielectric 0.5mm / Route2 0.035mm / dielectric 0.15mm / Route15 0.035mm / dielectric 0.2mm / Bottom 0.035mm
Design rules "default *": minimum track width 6mil, minimum drill 0.2mm, track to track 10mil, track to pad 6mil, pad to pad 6mil, via to via 6mil, smd to smd 6mil, copper to edge 40mil, drill to drill 6mil, minimum pad ring 10mil, minimum via ring 8mil, stop-mask expansion 4mil, vias tented up to drill 0mil, thermal gap 10mil

### Footprints (pad centres in the part's own frame; a part is rotated, then mirrored left to right if it is on the bottom)
MA03-1 = drill 1.016 long: 1 -2.54,0; 2 0,0; 3 2.54,0
BAT_MS621FE-FL11E = smd 2.2 x 0.65: + 5.05,0.75 | smd 2.3 x 0.65: - 5,-0.75
CAPC1005X55N = smd 0.54 x 0.6: 1 -0.432,0; 2 0.432,0
CAPC1608X90N = smd 0.87 x 0.93: 1 -0.78,0; 2 0.78,0
CAPC1005X55N' = smd 0.35 x 0.6: 1 -0.525,0; 2 0.525,0
CAPC1608X90 = smd 1.1 x 1: 1 -0.85,0; 2 0.85,0
C0603 = smd 1.1 x 1: 1 -0.85,0; 2 0.85,0
CAPPM3216X180N = smd 1.7 x 1.3: A -1.35,0; C 1.35,0
LED_SML-P11UTT86R = smd 0.5 x 0.6: A 0.45,0; C -0.45,0
SODFL3718X102N = smd 1.08 x 1.09: A 1.575,0; C -1.575,0
BEADC1608X95N = smd 0.9 x 1: 1 -0.8,0; 2 0.8,0
QFP50P1200X1200X160-64N = smd 1.475 x 0.3: 1 -5.738,3.75; 2 -5.738,3.25; 3 -5.738,2.75; 4 -5.738,2.25; 5 -5.738,1.75; 6 -5.738,1.25; 7 -5.738,0.75; 8 -5.738,0.25; 9 -5.738,-0.25; 10 -5.738,-0.75; 11 -5.738,-1.25; 12 -5.738,-1.75; 13 -5.738,-2.25; 14 -5.738,-2.75; 15 -5.738,-3.25; 16 -5.738,-3.75; 33 5.738,-3.75; 34 5.738,-3.25; 35 5.738,-2.75; 36 5.738,-2.25; 37 5.738,-1.75; 38 5.738,-1.25; 39 5.738,-0.75; 40 5.738,-0.25; 41 5.738,0.25; 42 5.738,0.75; 43 5.738,1.25; 44 5.738,1.75; 45 5.738,2.25; 46 5.738,2.75; 47 5.738,3.25; 48 5.738,3.75 | smd 0.3 x 1.475: 17 -3.75,-5.738; 18 -3.25,-5.738; 19 -2.75,-5.738; 20 -2.25,-5.738; 21 -1.75,-5.738; 22 -1.25,-5.738; 23 -0.75,-5.738; 24 -0.25,-5.738; 25 0.25,-5.738; 26 0.75,-5.738; 27 1.25,-5.738; 28 1.75,-5.738; 29 2.25,-5.738; 30 2.75,-5.738; 31 3.25,-5.738; 32 3.75,-5.738; 49 3.75,5.738; 50 3.25,5.738; 51 2.75,5.738; 52 2.25,5.738; 53 1.75,5.738; 54 1.25,5.738; 55 0.75,5.738; 56 0.25,5.738; 57 -0.25,5.738; 58 -0.75,5.738; 59 -1.25,5.738; 60 -1.75,5.738; 61 -2.25,5.738; 62 -2.75,5.738; 63 -3.25,5.738; 64 -3.75,5.738
AMPHENOL_10118192-0001LF = smd 0.4 x 1.35: 1 -1.3,0; 2 -0.65,0; 3 0,0; 4 0.65,0; 5 1.3,0 | smd 2.1 x 1.6: SH1 -3.1,-0.125; SH2 3.1,-0.125 | smd 1.8 x 1.9: SH3 -3.8,-2.675; SH6 3.8,-2.675 | smd 1.9 x 1.9: SH4 -1.2,-2.675; SH5 1.2,-2.675
MA09-2 = drill 1.016 octagon: 1 -10.16,-1.27; 2 -10.16,1.27; 3 -7.62,-1.27; 4 -7.62,1.27; 5 -5.08,-1.27; 6 -5.08,1.27; 7 -2.54,-1.27; 8 -2.54,1.27; 9 0,-1.27; 10 0,1.27; 11 2.54,-1.27; 12 2.54,1.27; 13 5.08,-1.27; 14 5.08,1.27; 15 7.62,-1.27; 16 7.62,1.27; 17 10.16,-1.27; 18 10.16,1.27
JST_B4B-XH-A = drill 1 square: 1 3.75,-0.525 | drill 1: 2 1.25,-0.525; 3 -1.25,-0.525; 4 -3.75,-0.525
JST_B5B-XH-A = drill 1 square: 1 5,-0.525 | drill 1: 2 2.5,-0.525; 3 0,-0.525; 4 -2.5,-0.525; 5 -5,-0.525
JST_B4B-PH-K-S = drill 0.8 square: 1 3,-0.55 | drill 0.8: 2 1,-0.55; 3 -1,-0.55; 4 -3,-0.55
HRS_U.FL-R-SMT-1(10) = smd 1.05 x 2.2: 1 -1.475,0; 3 1.475,0 | smd 1 x 1.05: 2 0,-1.525
JST_B2B-PH-K-S = drill 0.8 square: 1 1,-0.55 | drill 0.8: 2 -1,-0.55
INDC2012X145N = smd 1.2 x 1.47: 1 -0.86,0; 2 0.86,0
L3225M = smd 1.6 x 2.2: 1 -1.4,0; 2 1.4,0
RESC1005X40N = smd 0.54 x 0.6: 1 -0.432,0; 2 0.432,0
RESC1005X35N = smd 0.56 x 0.6: 1 -0.435,0; 2 0.435,0
R0402 = smd 0.635 x 0.635: 1 0,0.445; 2 0,-0.445
R0603 = smd 1 x 1.1: 1 -0.85,0; 2 0.85,0
MA03-2 = drill 1.016: 1 -2.54,-1.27 | drill 1.016 octagon: 2 -2.54,1.27; 3 0,-1.27; 4 0,1.27; 5 2.54,-1.27; 6 2.54,1.27
MA04-1 = drill 1.016 long: 1 -3.81,0; 2 -1.27,0; 3 1.27,0; 4 3.81,0
SW_1825910-6-4 = drill 0.99 square: 1 -3.25,2.25 | drill 0.99: 2 3.25,2.25; 3 -3.25,-2.25; 4 3.25,-2.25
PSON65P250X250X100-8N = smd 0.49 x 0.45: 1 0.97,0.975; 2 0.97,0.325; 3 0.97,-0.325; 4 0.97,-0.975; 5 -0.97,-0.975; 6 -0.97,-0.325; 7 -0.97,0.325; 8 -0.97,0.975
SON95P300X300X100-7N = smd 0.84 x 0.4: 1 -1.435,0.95; 2 -1.435,0; 3 -1.435,-0.95; 4 1.435,-0.95; 5 1.435,0; 6 1.435,0.95 | smd 1.625 x 2.365: 7 0,0
XCVR_NEO-6M-GPS = smd 1.8 x 0.8: 1 -6,7; 2 -6,5.9; 3 -6,4.8; 4 -6,3.7; 5 -6,2.6; 6 -6,1.5; 7 -6,0.4; 8 -6,-2.6; 9 -6,-3.7; 10 -6,-4.8; 11 -6,-5.9; 12 -6,-7; 13 6,-7; 14 6,-5.9; 15 6,-4.8; 16 6,-3.7; 17 6,-2.6; 18 6,0.4; 19 6,1.5; 20 6,2.6; 21 6,3.7; 22 6,4.8; 23 6,5.9; 24 6,7
QFN50P300X300X100-17N = smd 0.6 x 0.24: 1 -1.4,0.75; 2 -1.4,0.25; 3 -1.4,-0.25; 4 -1.4,-0.75; 9 1.4,-0.75; 10 1.4,-0.25; 11 1.4,0.25; 12 1.4,0.75 | smd 0.24 x 0.6: 5 -0.75,-1.4; 6 -0.25,-1.4; 7 0.25,-1.4; 8 0.75,-1.4; 13 0.75,1.4; 14 0.25,1.4; 15 -0.25,1.4; 16 -0.75,1.4 | smd 0.5 x 0.5: 17 0,0 | drill 0.2 pad 0.3: 18 0,0; 19 -0.58,0.58; 20 0.58,0.58; 21 -0.58,-0.58; 22 0.58,-0.58
CONV_TPS61022RWUR = smd 1.15 x 0.35: 1 -0.625,0.55; 3 -0.625,-0.55 | smd 1.45 x 0.2: 2 -0.475,0 | smd 0.45 x 0.25: 4 0.975,-0.75; 5 0.975,-0.25; 6 0.975,0.25; 7 0.975,0.75
VREG_LM5017MR/NOPB = smd 1.55 x 0.6: 1 -2.7,1.905; 2 -2.7,0.635; 3 -2.7,-0.635; 4 -2.7,-1.905; 5 2.7,-1.905; 6 2.7,-0.635; 7 2.7,0.635; 8 2.7,1.905 | smd 2.95 x 4.9: 9 0,0 | drill 0.2 pad 0.3: 10 -0.65,1.95; 11 0.65,1.95; 12 -0.65,0.65; 13 0.65,0.65; 14 -0.65,-0.65; 15 0.65,-0.65; 16 -0.65,-1.95; 17 0.65,-1.95
QFN50P300X300X100-17N' = smd 0.86 x 0.26: 1 -1.435,0.75; 2 -1.435,0.25; 3 -1.435,-0.25; 4 -1.435,-0.75; 9 1.435,-0.75; 10 1.435,-0.25; 11 1.435,0.25; 12 1.435,0.75 | smd 0.26 x 0.86: 5 -0.75,-1.435; 6 -0.25,-1.435; 7 0.25,-1.435; 8 0.75,-1.435; 13 0.75,1.435; 14 0.25,1.435; 15 -0.25,1.435; 16 -0.75,1.435 | smd 1.68 x 1.68: 17 0,0 | drill 0.2 pad 0.4: 18 0,0; 19 -0.58,0.58; 20 0.58,0.58; 21 -0.58,-0.58; 22 0.58,-0.58
SOIC127P794X203-8N = smd 1.473 x 0.559: 1 -3.759,1.905; 2 -3.759,0.635; 3 -3.759,-0.635; 4 -3.759,-1.905; 5 3.759,-1.905; 6 3.759,-0.635; 7 3.759,0.635; 8 3.759,1.905
XTAL_ABLS-8.000MHZ-B2-T = smd 5.6 x 2.1: 1 -4.75,0; 2 4.75,0
XTAL_ECS-.327-12.5-12QS-TR = smd 0.8 x 1.3: 1 -0.7,0; 2 0.7,0

### Placement (x,y rotation side)
BATTERY  3,9.6 90 top
BT1  29.6,54.9 180 top
C1  17.9,37.4 270 top
C2  12.9,40.5 180 top
C3  CC0402KRX7R7BB104  [CAPC1005X55N']  26.67,33.17 270 top
C4  28.42,33.64 270 top
C5  17.53,32.2 90 top
C6  34.8,40.3 180 top
C7  34.8,39 180 top
C8  34.8,37.7 180 top
C9  32.7,40.1 180 top
C10  29.38,38.64 0 top
C11  32.7,38.8 180 top
C12  32.7,37.5 180 top
C13  37.4,32.3 90 top
C14  36.1,32.3 90 top
C15  5.6,6.2 270 top
C16  9.8,13.4 180 top
C17  13.3,10 0 top
C18  26.7,14.4 90 top
C19  32.89,34.38 180 top
C20  32.15,31.9 180 top
C21  6.4,40.5 0 top
C22  37.47,34.83 0 top
C23  16,31.8 90 top
C24  40.8,46.2 90 top
C25  39.1,46.2 90 top
C26  28.9,14.4 90 top
C27  31.1,14.4 90 top
C28  33.3,14.4 90 top
C29  20.4,18.7 180 top
C30  20.4,16.6 0 top
C31  7.5,17.5 270 top
C32  9.7,17.5 270 top
C33  38.1,8 270 top
C34  35.9,8 270 top
C35  28.5,8.1 270 top
C36  21.5,5.5 180 top
C37  17.6,5.5 0 top
C38  16.4,10.4 90 top
D1  56.06,32.92 270 top
D2  56.06,35.72 90 top
D3  25.65,31.57 180 top
D4  26.6,49.3 0 top
D5  3.2,55.1 0 top
D6  12.5,8.3 0 top
D7  9.5,6.2 270 top
D8  2,-3.1 0 top  (outside the outline)
D9  2,-9.2 0 top  (outside the outline)
D10  2,-15.3 0 top  (outside the outline)
FB1  36.94,38.31 90 top
IC1  47.3,35.08 0 top
J1  4.7,28.48 270 top
J2  22.1,25.18 0 top
J3  56.3,55.4 0 top
J4  41.6,55.4 0 top
J7  42.2,16.7 0 top
J8  2.2,44.5 90 top
J9  3.7,17.4 270 top
L1  5.6,45.3 90 top
L2  23.8,17.2 90 top
L3  32.2,5.3 180 top
L4  24.6,8.1 0 top
R1  54.79,33.17 90 top
R2  54.79,35.46 270 top
R3  46.41,44.73 270 top
R4  52.76,26.82 270 top
R5  54.54,25.81 270 top
R6  24.77,33.09 180 top
R7  44.8,45.2 180 top
R8  17.65,40.67 180 top
R9  5.6,55.1 0 top
R10  24.1,49.3 0 top
R11  42.7,45.2 0 top
R12  5.8,47.6 270 top
R13  13,12.2 180 top
R14  6.4,12.9 0 top
R15  11.8,6.2 0 top
R16  14.6,7.1 270 top
R17  23.8,13.5 180 top
R18  16.1,14.1 0 top
R19  21,13.9 90 top
R20  33.7,11.1 180 top
R21  29.5,11.1 180 top
R22  23.6,10.7 0 top
STLINK_INTERFACE  53,48.5 0 top
SV1  74,54.7 180 top
SV2  74,24.5 0 top
SW1  22.99,37.62 0 top
U1  35.8,44.4 0 top
U2  21.46,32.2 0 top
U3  14.2,50.3 0 top
U4  19.6,8.6 180 top
U5  31.5,8.3 180 top
U6  14.9,17.9 0 top
U7  BQ24074RGTR  [QFN50P300X300X100-17N']  9.2,9.7 0 top
U$1  27.4,45.5 180 top
Y1  8.89,36.61 0 top
Y2  39.94,42.83 0 top

### Tracks (layer width: path | path; a pad name or v marks a point on that pad's centre or on a via)
3V3  (via drill 0.35)
  Top 0.203: IC1.48 53.37,39.16 v54.54,39.16 | J2.4 v14.48,28.23 | U2.4 23.37,31.26 v24.03,31.92 24.33,32.22 R6.2 24.33,33.83 24.64,34.14 26.22,34.14 C3.1 27.46,34.49 C4.1 28.42,38.52 C10.1 28.53,39.36 29.84,40.67 32.59,40.67 32.79,40.47 32.79,40.44 C9.1 C11.1 C12.1 | IC1.32 51.38,29.01 v51.38,27.97 | IC1.64 43.53,40.8 v42.86,40.8 41.56,39.5 IC1.1 | R8.2 17.14,40.59 v17.14,39.02 | R5.1 55.63,26.24 v55.68,26.19 | R4.1 53.47,27.97 v53.78,27.97 | v45.29,27.21 45.29,27.86 44.55,28.59 IC1.19 | R7.2 43.8,45.2 | 43.8,45.2 R11.2 | 43.8,45.2 43.8,44.5 v44.2,44.1 | U1.6 35,44.25 35.15,44.25 35.63,44.73 | 35.63,44.73 U1.2 36.94,44.9 37.09,44.9 37.57,45.38 37.57,46.83 v37.2,47.2 | U1.8 34.98,45.38 35.63,44.73 | D4.A v28.1,49.3 | U3.23 v21.9,56.2 | J4.1 v46.6,56.2 | U$1.8 22.94,44.3 v22.43,44.3 | FB1.2 36.17,39.88 | 36.17,39.88 35.75,40.3 C6.1 C7.1 C8.1 | 36.17,39.88 36.17,40.38 v36.38,40.58 | STLINK_INTERFACE.5 55.54,45.86 v55.6,45.8 | U4.14 19.39,7.16 19.39,6.91 19.66,6.65 23.5,6.65 | 23.5,6.65 24.55,6.65 L4.2 26,9.15 R22.2 25.65,11.9 v25.7,11.9 | C36.1 23.5,6.65 | J7.1 v45.2,17.8
  Route2 0.203: J3.1 60.05,56.15 v60,56.2
  pour Route3: 1,59 79,59 79,1 1,1
5V  (1 unrouted)
  Top 0.203: 17.51,31.37 C5.1 | C34.1 36,8.85 | C33.1 42.95,13.7 48.8,13.7 56.8,21.7 75.4,21.7 76.5,22.8 76.5,48.39 SV1.4
  Top 0.305: 13.45,31.95 15.22,31.95 15.81,31.37 C23.1 17.51,31.37 | U2.6 22.9,33.25 22.38,33.77 20.42,33.77 20.03,33.38 U2.1 19.33,33.16 C5.1 | 13.15,25.24 J2.3 16.39,22 20.9,22 22.1,20.8 31.3,20.8 34.55,17.55 R20.1 36,9.65 36,8.85 C33.1 | U5.3 C34.1
5V_IN  (3 unrouted)
  Top 0.305: J2.2 8.61,29.78 7.07,29.78 6.5,29.78 8.1,28.18 8.1,22.7 9.5,21.3 20.4,21.3 21.7,20 25.4,20 25.7,19.7 25.7,17.2 24.3,15.8 | 24.65,13.3 23.25,11.9 18.1,11.9 16.9,13.1 14.64,13.1 14.34,13.4 C16.1 10.65,11.84 U7.13
5V_IN_SOLAR  (1 unrouted)
  Top 0.203: R17.1 24.7,13.55
  Top 0.305: L2.1 24.65,14.95 R17.1 | 24.7,13.55 C18.1 C26.1 C27.1 C28.1
5V_IN_USB  (1 unrouted)
BAT
  Top 0.203: U7.2 U7.3 7.75,9.43 7.35,9.43 5.59,7.68 C15.1 | BATTERY.1 C15.1 | C15.1
BOOT
  Top 0.203: U6.7 17.77,18.7 C29.2
BOOT0  (via drill 0.35)
  Top 0.203: v48.3,32.69 49.11,33.5 49.11,34.05 45.15,38.01 45.15,39.02 45.55,39.43 IC1.60 45.55,43.44 R3.2
  Route2 0.203: v48.3,32.69 47.7,32.09 46.3,32.09 39.15,24.93 30.73,24.93 J2.15
CHG
  Top 0.203: U7.9 11.4,8.95 D6.C
FB  (via drill 0.35)
  Top 0.203: R17.2 22.5,13.05 R19.1 20.15,13.05 v19.7,13.5 | U6.5 17.6,15.6 v18,15.2
  Route2 0.203: v18,15.2 v19.7,13.5
FB2
  Top 0.203: R20.2 32.58,11.1 U5.4 30.52,10.93 R21.1
GND  (via drill 0.35)  (46 unrouted)
  Top 0.152: U4.15 19.82,7.22 19.82,7.44 19.6,7.66 19.6,7.78
  Top 0.203: J1.5 6.25,27.18 v6.35,27.08 | J2.18 J2.17 v34.16,23.91 | D1.C v56.06,34.32 D2.C | IC1.47 54.47,38.33 v54.54,38.25 | SW1.4 SW1.3 18.51,35.37 | C5.2 16.33,33.05 16,32.73 | v19.05,31.57 19.68,32.2 U2.2 U2.7 21.46,31.77 22.45,30.78 25.32,30.78 25.71,31.16 25.71,31.17 D3.C 26.67,32.13 C3.2 28.27,32.64 C4.2 30.01,34.38 C19.C | IC1.31 50.55,27.77 v51.37,26.95 | IC1.63 44.05,41.56 42.68,42.94 v42.66,42.94 | IC1.12 40.36,33.33 40.08,33.61 37.41,33.61 36.62,34.41 C22.1 | 18.51,35.37 17.91,35.97 C1.2 | 18.51,35.37 18.03,34.9 v18.03,34.7 | v46.41,46.13 R3.1 | C22.1 v36.63,36 | 30.1,32.6 C20.C 31.54,32.64 C19.C | U1.1 36.29,45.85 33.95,45.85 33.21,45.11 33.21,44.99 | U1.5 33.88,43.42 33.6,43.7 33.6,44.6 | U1.7 33.73,44.73 33.6,44.6 | 33.6,44.6 33.21,44.99 | BT1.- 23.35,55.65 21.7,57.3 | U3.24 21.7,57.3 | J4.5 v36.6,56.1 | J3.2 57.5,54.92 v57.5,56.2 | D5.C 2.75,54.15 v2.8,54.1 | v6.3,42.7 7.6,42.7 U3.12 9.3,43.3 9.5,43.5 9.5,45.1 9.1,45.5 U3.10 | U3.13 21.7,43.3 21.8,43.4 21.8,45.9 | 21.8,45.9 v21.8,46.9 | 21.7,57.3 21.9,57.5 v21.9,57.8 | U3.7 v6.6,50.7 | C22.1 36.08,34.29 36.08,32.75 C14.2 C13.2 | IC1.18 44.05,27.54 v44.38,27.21 | v32.93,45.11 33.09,45.11 33.21,44.99 | SV1.3 72.73,53.13 v72.7,53.1 | U$1.7 22.84,44.86 21.8,45.9 | U$1.1 U$1.2 U$1.3 U$1.4 31.8,47.41 v32.5,46.7 | C23.2 16,32.73 | 16,32.73 15.75,32.98 v15.75,33.48 | C2.2 v9.5,40.5 C21.2 | C25.2 C24.2 40,47.78 v40,48.4 | C6.2 C7.2 C8.2 34.37,37.2 C19.C | C9.2 C11.2 C12.2 31.54,36.77 | C19.C 31.54,36.77 | C10.2 31.54,37.33 31.54,36.77 | J8.3 v2.2,47.2 | J8.1 2.2,41.7 v2.3,41.6 | STLINK_INTERFACE.1 50.46,48.44 v50.5,48.48 | v9.74,23.91 J2.1 | J9.1 v4.4,16.4 7.25,16.4 C31.2 C32.2
  Top 0.203: C30.2 21,16.35 R19.2 20.95,14.7 v19.8,14.7 | C28.2 C27.2 C26.2 C18.2 26.7,15.6 v26,16.3 | U7.4 7.76,8.87 v7.2,8.3 7.2,6.95 C15.2 | BATTERY.2 v5,9.6 | v9,14.4 8.95,14.35 C16.2 8.95,12.73 9.43,12.25 9.43,11.15 U7.14 9.45,9.95 U7.17 | R14.1 5.55,11.75 v5.7,11.6 | U4.15 U4.16 20.43,7.28 v21.57,7.28 | U4.5 U4.6 | U4.6 U4.7 U4.8 17.6,11.25 C38.2 15.55,12.1 v14.9,12.1 13.95,12.1 R13.1 14.15,11.9 C17.2 | C37.2 C36.2 20.05,4.9 v19.6,4.9 | U5.6 31.04,8.05 31.34,7.75 U5.1 32.23,7.65 35.4,7.65 C34.2 C33.2 37.05,6.1 v37,6.1 | C35.2 28.5,7.54 27.75,8.29 27.75,10.2 R21.2 v27.4,11.1 | J7.4 v39.2,17.8 | U6.1 v10.3,19.8 | v8.48,7.1 8.95,7.57 U7.6 8.95,8.59 9.07,8.71 | U7.8 10.62,7.6 v10.8,7.6 | U6.9 14.86,17.94 14.86,18.8 14.5,19.16 13.64,19.16 | 13.6,19.8 | U4.6 19.6,9.75 19.6,9.46
  pour Route2: 1,59 79,59 79,1 1,1
GPS_SCL  (via drill 0.35)
  Top 0.203: v21.8,50.5 21.8,51.5 21.5,51.8 U3.19 | U$1.6 22.9,46.87 22.8,46.87 22.05,47.62 v22.05,47.95
  Route2 0.203: v22.05,47.95 22.05,50.25 v21.8,50.5
GPS_SDA
  Top 0.203: U$1.5 23.5,47.41 U3.18
I2C1_SCL_BME  (via drill 0.35)
  Top 0.203: J2.11 25.15,23.91 25.85,24.62 25.85,26.81 26.59,27.54 40.46,27.54 v40.95,28.04 | v48.28,33.68 44.35,37.61 44.35,39.14 45.05,39.84 IC1.61 45.05,45.1 R7.1 45.23,45.3 40.6,49.94 36.84,49.94 32.3,45.4 32.3,44.3 33.8,42.8 36.15,42.8 U1.4
  Route2 0.203: v48.28,33.68 47.65,33.05 46.2,33.05 41.19,28.04 v40.95,28.04
I2C1_SDA_BME  (via drill 0.35)
  Top 0.203: J2.12 24.64,26.95 25.89,28.2 39.57,28.2 v40.06,28.69 | v46.54,33.68 43.77,36.45 43.77,39.27 44.55,40.05 IC1.62 44.55,42.53 42.26,44.82 R11.1 42.27,47.42 40.64,49.04 39.14,49.04 38.1,48 38.1,44.4 37.77,44.08 U1.3
  Route2 0.203: v46.54,33.68 46.03,33.68 43.66,31.32 42.65,31.32 40.06,28.73 v40.06,28.69
I2C2_SCL_CO  (via drill 0.35)
  Top 0.203: J2.13 27.18,22.85 27.74,22.29 42,22.29 v46.22,26.51 | IC1.29 49.55,28.06 v48.83,27.33 48.83,26.44 49.89,25.38 R5.2 56.65,25.38 59.37,28.1 59.37,50.56 J3.3
  Route2 0.203: v46.22,26.51 47.04,27.33 v48.83,27.33
I2C2_SDA_CO  (via drill 0.35)
  Top 0.203: J2.14 28.32,25.31 28.32,22.96 28.48,22.8 41.62,22.8 44.51,25.68 v44.51,25.81 | IC1.30 50.05,26.87 v50.09,26.82 50.09,26.44 50.22,26.32 52.69,26.32 R4.2 53.22,26.39 54.29,27.46 56.8,27.46 58.73,29.39 58.73,48.69 J3.4
  Route2 0.203: v44.51,25.81 49.08,25.81 v50.09,26.82
ILIM
  Top 0.203: U7.12 12.15,11.96 R13.2
ISET
  Top 0.203: U7.16 7.25,12.34 R14.2
LED_G
  Top 0.203: R2.2 54.67,35.03 54.46,34.83 IC1.40
LED_R
  Top 0.203: IC1.38 54.57,33.83 R1.2
N$1
  Top 0.203: R6.1 D3.A
N$2
  Top 0.203: R1.1 55.79,32.74 D1.A
N$3
  Top 0.203: U3.3 R9.2
N$4
  Top 0.203: R2.1 55.66,35.89 55.66,35.9 55.8,35.9 D2.A
N$6
  Top 0.203: IC1.11 40.51,33.83 39.52,34.83 C22.2
N$7
  Top 0.203: D4.C R10.2
N$8
  Top 0.203: U3.8 8.1,47.6 R12.1 7.25,46.6 U3.9
N$9
  Top 0.203: L1.2 5.36,46.4 R12.2
N$10
  Top 0.203: BT1.+ 22.85,54.15 22.65,54.35 | 22.65,54.35 21.9,55.1 U3.22 | R10.1 22.65,50.32 22.65,54.35
N$12
  Top 0.203: D5.A R9.1
N$15  (1 unrouted)
  Top 0.203: U6.3 U6.2
N$17
  Top 0.203: R16.1 13.3,7.95 D6.A
N$18
  Top 0.203: D7.A 9.9,6.15 9.96,6.2 R15.1
NRST  (via drill 0.35)
  Top 0.203: 18.88,39.87 SW1.1 SW1.2 27.63,41.27 36.59,41.27 38.08,39.78 38.08,37.02 39.27,35.83 IC1.7 42.31,35.83 42.55,35.59 42.55,35.13 v43.49,34.19 44.71,34.19 47.11,31.79 48.39,31.79 51.6,35 51.6,44.75 52.16,45.31 52.16,46.39 STLINK_INTERFACE.3 | 18.88,39.87 R8.1 | C1.1 17.9,38.89 18.88,39.87
  Route2 0.203: v43.49,34.19 42.34,33.05 39.29,33.05 36.13,29.88 33.02,29.88 29.72,26.58 J2.16
PC14-OSC32-IN
  Top 0.203: IC1.3 40.73,37.83 40.21,38.35 40.21,41.88 40.63,42.31 Y2.2 40.63,45.25 C24.1
PC15-OSC32-OUT
  Top 0.203: IC1.4 40.53,37.33 39.73,38.13 39.73,42.34 Y2.1 39.23,45.28 C25.1
PG
  Top 0.203: U4.4 22.35,10.7 R22.1
PG2
  Top 0.203: R18.1 14.1,14.1 U6.4
PGOOD
  Top 0.203: U7.7 9.5,8.21 D7.C
PH0-OSC-IN  (via drill 0.35)
  Top 0.203: IC1.5 41.53,36.86 40,36.86 39.19,37.66 39.19,40.37 37.3,42.27 22.33,42.27 v22.17,42.43 | v15.24,40.92 14.1,40.92 C2.1 13.68,36.65 Y1.2
  Route2 0.203: v22.17,42.43 21.27,41.52 15.84,41.52 v15.24,40.92
PH1-OSC-OUT
  Top 0.203: Y1.1 4.14,39 4.14,39.02 C21.1 5.62,40.8 6.6,41.78 36.98,41.78 38.64,40.13 38.64,37.37 39.68,36.33 IC1.6
RF_IN
  Top 0.203: L1.1 5.6,44.4 | 3.79,44.44 J8.2
  Top 0.89: U3.11 5.6,44.4 | L1.1 3.79,44.44
SOLAR_IN  (1 unrouted)
  Top 0.203: J9.2 7.45,18.4 C31.1 C32.1 9.88,18.54
SS/TR
  Top 0.203: C38.1 18,9.55 U4.9
SW
  Top 0.203: U4.2 22.95,8.35 L4.1 | U4.1 U4.2 | U4.3 U4.2
SW2  (via drill 0.35)
  Top 0.203: U5.2 31.98,8.32 31.55,8.32 31.2,8.67 31.2,9.03 31.75,9.58 v33.8,9.58 | v35.2,5.3 L3.1
  Route2 0.203: v33.8,9.58 33.8,6.7 v35.2,5.3
SW3
  Top 0.203: L2.2 23.7,18.7 C29.1 20.14,19.8 U6.8
SWCLK
  Top 0.203: IC1.49 51.05,44.85 51.7,45.5 51.7,48.47 STLINK_INTERFACE.4
SWDIO
  Top 0.203: IC1.46 53.13,37.73 53.88,37.73 54.12,37.5 55.2,37.5 57.5,39.8 57.5,48.3 56.03,49.77 STLINK_INTERFACE.6
SYS
  Top 0.203: U7.10 U7.11 12.4,9.95 | 12.4,9.95 C17.1 | R16.2 12.7,6.25 R15.2 12.65,5.55 12,4.9 8.6,4.9 7.85,5.65 7.85,7.66 U7.5 | R16.2 15.8,7.45 15.8,8.4 15,9.2 12.7,9.2 12.4,9.5 12.4,9.95 | U4.10 U4.11 U4.12 U4.13 18.45,7.2 C37.1 | C37.1 15.35,5.5 R16.2 | U5.5 28.9,8.55 | 28.9,8.55 C35.1 | 28.9,8.55 29.9,7.55 U5.7 30.8,7.28 L3.2 24.3,5.3 23.1,4.1 18.15,4.1 C37.1
TRACESWO
  Top 0.203: IC1.55 48.05,43.07 48.54,43.56 48.54,47.85 STLINK_INTERFACE.2
TS
  Top 0.203: U7.1 4.69,10.45 BATTERY.3
UART1_RX_LORA  (via drill 0.35)
  Top 0.203: J2.6 17.02,28.74 18.07,29.79 37.41,29.79 39.17,31.55 v39.19,31.55 | v46.79,38.76 46.55,39 IC1.58 46.55,42.22 48.08,43.75 48.08,46.48 44.48,50.08 41.12,50.08 39.1,52.1 J4.4
  Route2 0.203: v39.19,31.55 39.39,31.75 40.29,31.75 40.34,31.8 43.24,31.8 46.79,35.35 v46.79,38.76
UART1_TX_LORA  (via drill 0.35)
  Top 0.203: J2.5 15.88,25.05 15.88,28.96 17.19,30.27 36.93,30.27 39.07,32.41 v39.55,32.41 | v45.78,38.76 46.05,39.04 IC1.59 46.05,42.72 47.43,44.1 47.43,46.23 44.56,49.1 v42.7,49.1 | v41.6,51 J4.3
  Route2 0.203: v39.55,32.41 42.92,32.41 45.78,35.27 v45.78,38.76 | v42.7,49.1 41.6,50.2 v41.6,51
UART2_RX_CO2  (via drill 0.35)
  Top 0.203: J2.8 20.83,25.18 20.83,23.73 23.22,21.34 43.14,21.34 v43.28,21.48 | v43.36,27.97 43.55,28.16 IC1.17 | v65.5,27 72.77,27 SV2.3
  Route2 0.203: v43.28,21.48 43.28,27.88 v43.36,27.97 46.41,31.02 51.1,31.02 53.02,29.1 59.1,29.1 61.2,27 v65.5,27
UART2_TX_CO2  (via drill 0.35)
  Top 0.203: J2.7 18.41,25.05 18.41,28.1 19.62,29.31 38.19,29.31 40.21,31.33 IC1.16 51.56,31.33 52.89,30 v54.79,30 | SV2.2 70.93,26.3 64.4,26.3 61.74,30 v60.04,30
  Route2 0.203: v60.04,30 v54.79,30
UART3_RX_GPS  (via drill 0.35)
  Top 0.203: J2.10 22.1,27.85 23,28.76 38.66,28.76 40.73,30.83 46.98,30.83 47.55,30.26 IC1.25 47.55,26.65 48.55,25.65 | 48.55,25.65 49.9,24.3 56.4,24.3 v60.7,28.6 | v21.95,53.95 20.25,53.95 U3.21 | 48.55,25.65 48.3,25.4 v48.3,24.4 | v41.7,20.1 41.2,19.6 J7.3
  Route2 0.203: v60.7,28.6 60.7,34.3 42.3,52.7 23.2,52.7 v21.95,53.95 | v48.3,24.4 44,20.1 v41.7,20.1
UART3_TX_GPS  (via drill 0.35)
  Top 0.203: J2.9 22.1,23.9 24.17,21.83 42.73,21.83 43.02,22.11 44.81,22.11 | v61.7,28.6 61.7,28.2 57.04,23.54 47.86,23.54 47.05,24.35 | v21.9,52.6 20.5,52.6 U3.20 | IC1.24 47.05,24.35 | 44.81,22.11 47.05,24.35 | J7.2 43.2,20.5 44.81,22.11
  Route2 0.203: v61.7,28.6 61.7,34.2 42.1,53.8 34.3,53.8 33.4,54.7 21.8,54.7 21.2,54.1 21.2,53.3 v21.9,52.6
VCC
  Top 0.203: U6.6 18.89,17.27 C30.1 19.55,15.5 18.15,14.1 R18.2
VREF_PLUS
  Top 0.203: IC1.13 40.13,32.83 39.89,33.08 38.63,33.08 37.77,32.21 37.74,32.21 C13.1 C14.1 36.07,31.9 C20.A 34.24,32.64 C19.A 34.24,36.09 34.81,36.66 36.09,36.66 FB1.1

### Text on the board
tPlace: 3v3 | 3v3 | 3v3 | CO2 PWR | LORA | CO | CO2 UART | Solar | ⣿⣿⣿⣿⣿⣿⣿⣿⣿⣿⣿⣿⣿⣿⣿⣿⣿⣿⣿⣿⣿⣿⣿⣿⣿⣿⣿⣿⣿⣿ / ⣿⣿⣿⣿⣿⣿⣿⣿⡿⠿⣿⣿⣿⣿⣿⣿⣿⡎⠻⣿⣿⣿⣿⣿⣿⣿⣿⣿⣿⣿ / ⣿⣿⣿⣿⣿⣿⣿⣿⡇⠀⢻⣿⣿⢿⣿⣿⣿⡇⠀⠈⢻⣿⣿⣿⣿⣿⣿⣿⣿⣿ / ⣿⣿⣿⣿⣿⣿⣿⣿⣷⡀⣸⣿⣿⠈⠙⠛⠋⠀⠀⠀⠈⣿⣿⣿⣿⣿⣿⣿⣿⣿ / ⣿⣿⣿⣿⣿⣿⣿⣿⢿⣿⣿⣿⣿⠀⠀⠀⠀⠀⠀⠀⢀⣿⣿⣿⣿⣿⣿⣿⣿⣿ / ⣿⣿⣿⣿⣿⣿⡟⠁⠈⢿⣿⣿⠇⠀⠀⠀⠀⠀⠀⠀⣼⣿⣿⣿⣿⣿⣿⣿⣿⣿ / ⣿⣿⣿⣿⣿⡏⠀⠀⠀⠀⠈⠀⠀⠀⢠⡀⣀⣴⠀⠀⣿⣿⣿⣿⣏⠻⣿⣿⣿⣿ / ⣿⣿⣿⣿⣿⠁⠀⠀⠀⠀⠀⠀⠀⠀⣼⣿⣿⣿⠀⠀⠙⢿⣿⣿⡿⠀⠘⣿⣿⣿ / ⣿⣿⣿⣿⣿⡆⠀⠀⠀⣦⣄⣠⣴⣾⣿⣿⣿⣿⡀⠀⠀⠀⠉⠉⠀⠀⠀⣿⣿⣿ / ⣿⣿⣿⣿⣿⣷⠀⠀⠀⢹⣿⣿⡿⠟⢛⣿⣿⣿⣷⣄⠀⢀⠀⠀⠀⠀⢠⣿⣿⣿ / ⣿⣿⣿⣿⣿⣿⣧⣠⣴⠾⠛⢁⡠⠖⠋⠉⠹⣿⣿⣿⣿⡟⠀⠀⠀⣠⣿⣿⣿⣿ / ⣿⣿⣿⣿⣿⡿⠟⠋⠀⠀⠀⠀⣠⡶⠾⠿⠶⣿⡆⠉⠉⠛⠻⠷⢾⣿⣿⣿⣿⣿ / ⣿⣿⣿⣿⡇⠀⠀⠀⠀⡀⠀⣸⡏⢠⠔⠙⣦⡈⢿⠀⠀⠐⠲⠤⣤⣴⣿⣿⣿⣿ / ⣿⣿⣿⣿⣿⣤⡴⠞⢁⣠⣴⣿⣇⠘⠦⢠⡾⢁⣾⣀⡀⠀⠀⠒⢶⣾⣿⣿⣿⣿ / ⣿⣿⣿⣿⣿⣿⣷⣾⣿⣿⣿⣿⣿⣷⣦⣤⣴⣿⣿⣿⣿⣿⣷⣶⣶⣿⣿⣿⣿⣿ | Ember Watch | Battery